# EAGLE design CCM_0015 (EAGLE 8.6.0)

## Sheet 1 of 6: CCM Subrack Bus
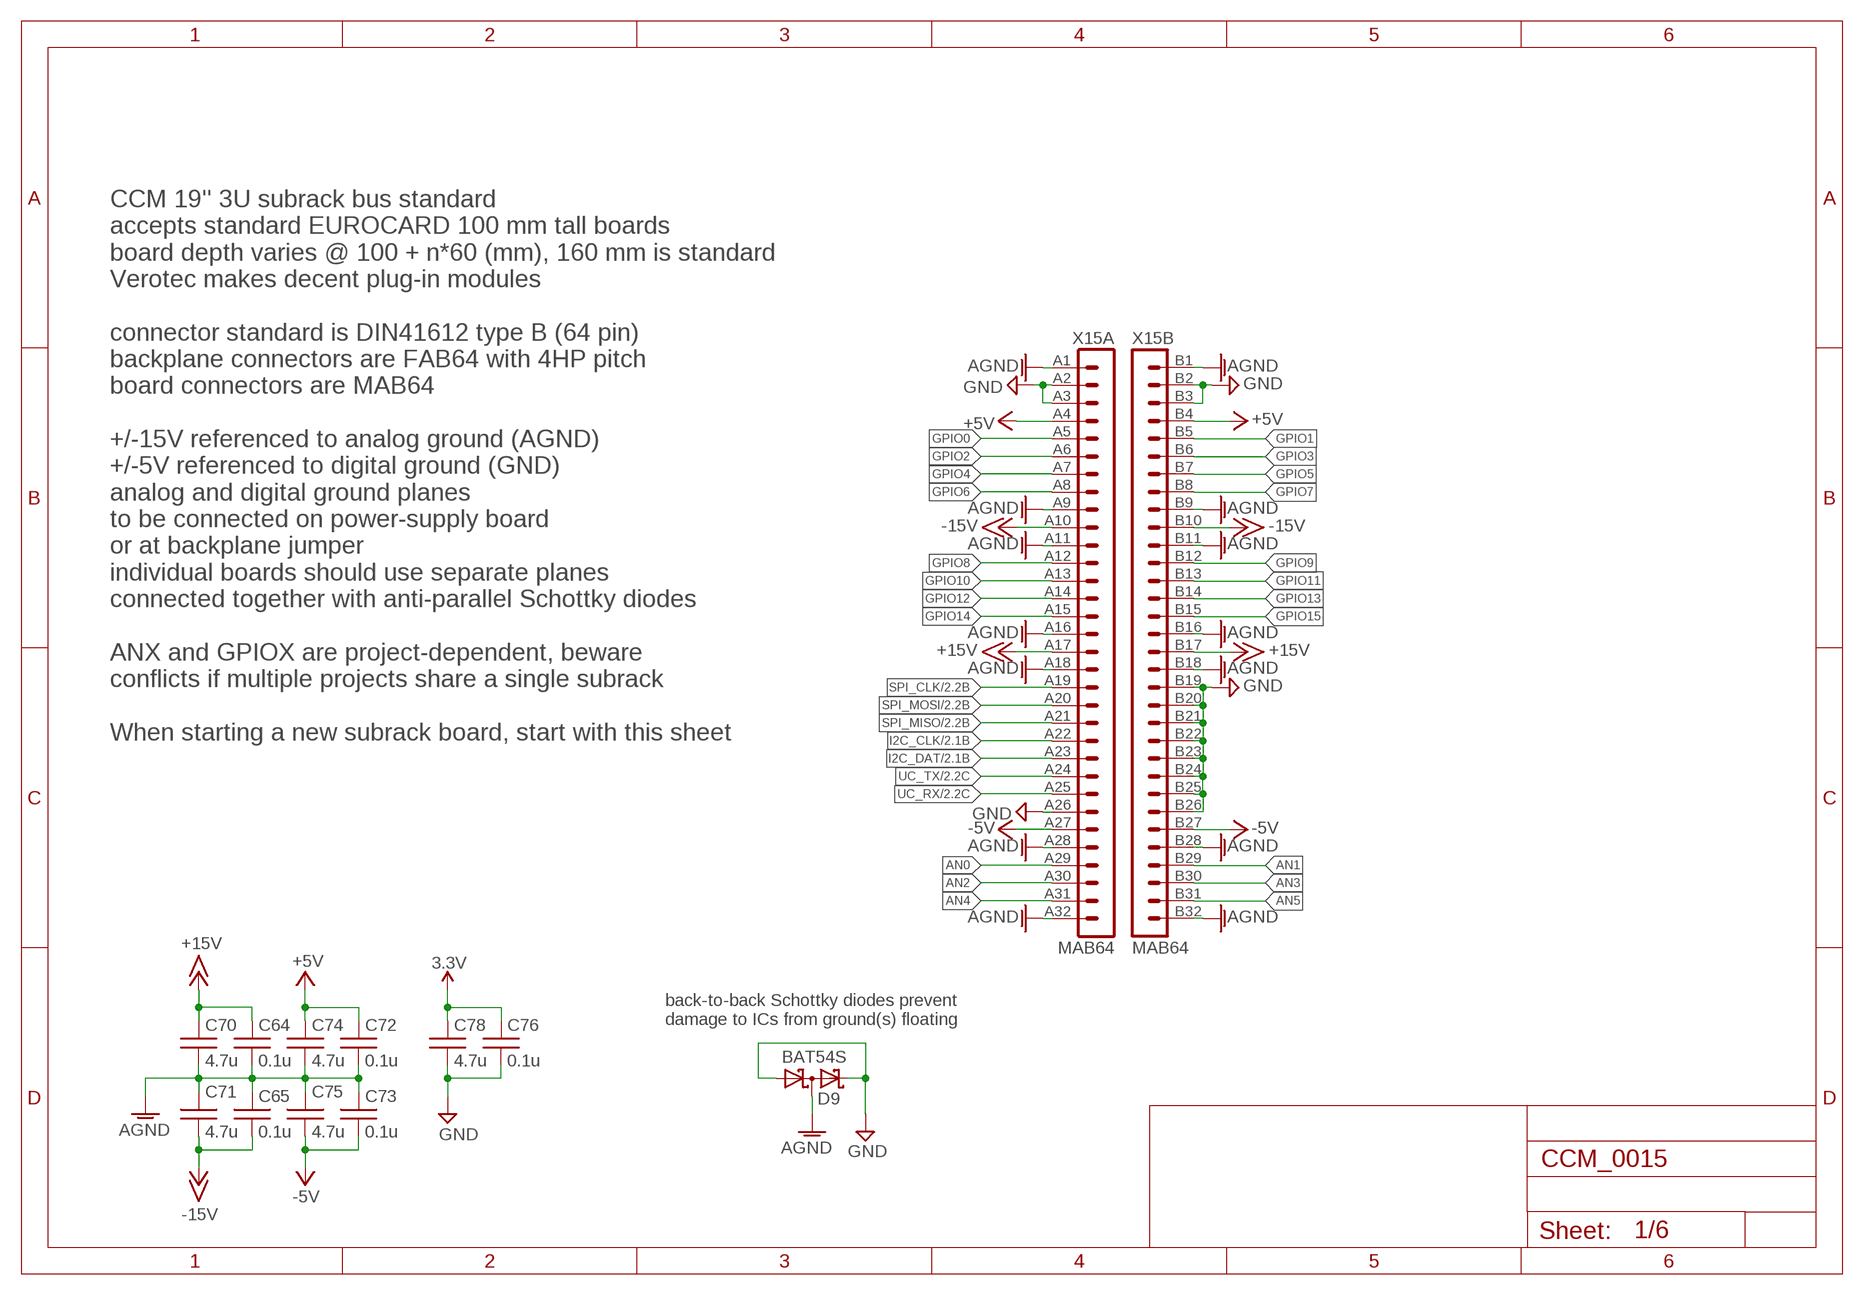
[diagram p0: schematic, sheet 1]

### Parts
C64  0.1u  C0603  [0603]
C65  0.1u  C0603  [0603]
C70  4.7u  C0603  [0603]
C71  4.7u  C0603  [0603]
C72  0.1u  C0603  [0603]
C73  0.1u  C0603  [0603]
C74  4.7u  C0603  [0603]
C75  4.7u  C0603  [0603]
C76  0.1u  C0603  [0603]
C78  4.7u  C0603  [0603]
D9  BAT54S  [SOT23]
X15  MAB64  [MAB64]

### Nets
3.3V: C76.1 C78.1 ; also sheet 3,4,5,6
+5V: C72.1 C74.1 X15.A4 X15.B4 ; also sheet 2,3,4,5
+15V: C64.1 C70.1 X15.A17 X15.B17
-5V: C73.2 C75.2 X15.A27 X15.B27 ; also sheet 4
-15V: C65.2 C71.2 X15.A10 X15.B10
AGND: C64.2 C65.1 C70.2 C71.1 D9.3(C1A2) X15.A1 X15.A9 X15.A11 X15.A16 X15.A18 X15.A28 X15.A32 X15.B1 X15.B9 X15.B11 X15.B16 X15.B18 X15.B28 X15.B32 ; also sheet 3,4,5,6
AGND1: C72.2 C73.1 C74.2 C75.1
AN0: X15.A29
AN1: X15.B29
AN2: X15.A30
AN3: X15.B30
AN4: X15.A31
AN5: X15.B31
GND: C76.2 C78.2 D9.1(A1) D9.2(C2) X15.A2 X15.A3 X15.A26 X15.B2 X15.B3 X15.B19 X15.B20 X15.B21 X15.B22 X15.B23 X15.B24 X15.B25 X15.B26 ; also sheet 2,3,4,5
GPIO0: X15.A5
GPIO1: X15.B5
GPIO2: X15.A6
GPIO3: X15.B6
GPIO4: X15.A7
GPIO5: X15.B7
GPIO6: X15.A8
GPIO7: X15.B8
GPIO8: X15.A12
GPIO9: X15.B12
GPIO10: X15.A13
GPIO11: X15.B13
GPIO12: X15.A14
GPIO13: X15.B14
GPIO14: X15.A15
GPIO15: X15.B15
I2C_CLK: X15.A22 ; also sheet 2
I2C_DAT: X15.A23 ; also sheet 2
SPI_CLK: X15.A19 ; also sheet 2,3,4,5
SPI_MISO: X15.A21 ; also sheet 2,4,5
SPI_MOSI: X15.A20 ; also sheet 2,3,4,5
UC_RX: X15.A25 ; also sheet 2
UC_TX: X15.A24 ; also sheet 2

### Notes on the sheet
- CCM 19'' 3U subrack bus standard
  accepts standard EUROCARD 100 mm tall boards
  board depth varies @ 100 + n*60 (mm), 160 mm is standard
  Verotec makes decent plug-in modules
  
  connector standard is DIN41612 type B (64 pin)
  backplane connectors are FAB64 with 4HP pitch 
  board connectors are MAB64
  
  +/-15V referenced to analog ground (AGND)
  +/-5V referenced to digital ground (GND)
  analog and digital ground planes
  to be connected on power-supply board
  or at backplane jumper
  individual boards should use separate planes
  connected together with anti-parallel Schottky diodes
  
  ANX and GPIOX are project-dependent, beware 
  conflicts if multiple projects share a single subrack
  
  When starting a new subrack board, start with this sheet
- back-to-back Schottky diodes prevent 
  damage to ICs from ground(s) floating

## Sheet 2 of 6: uC
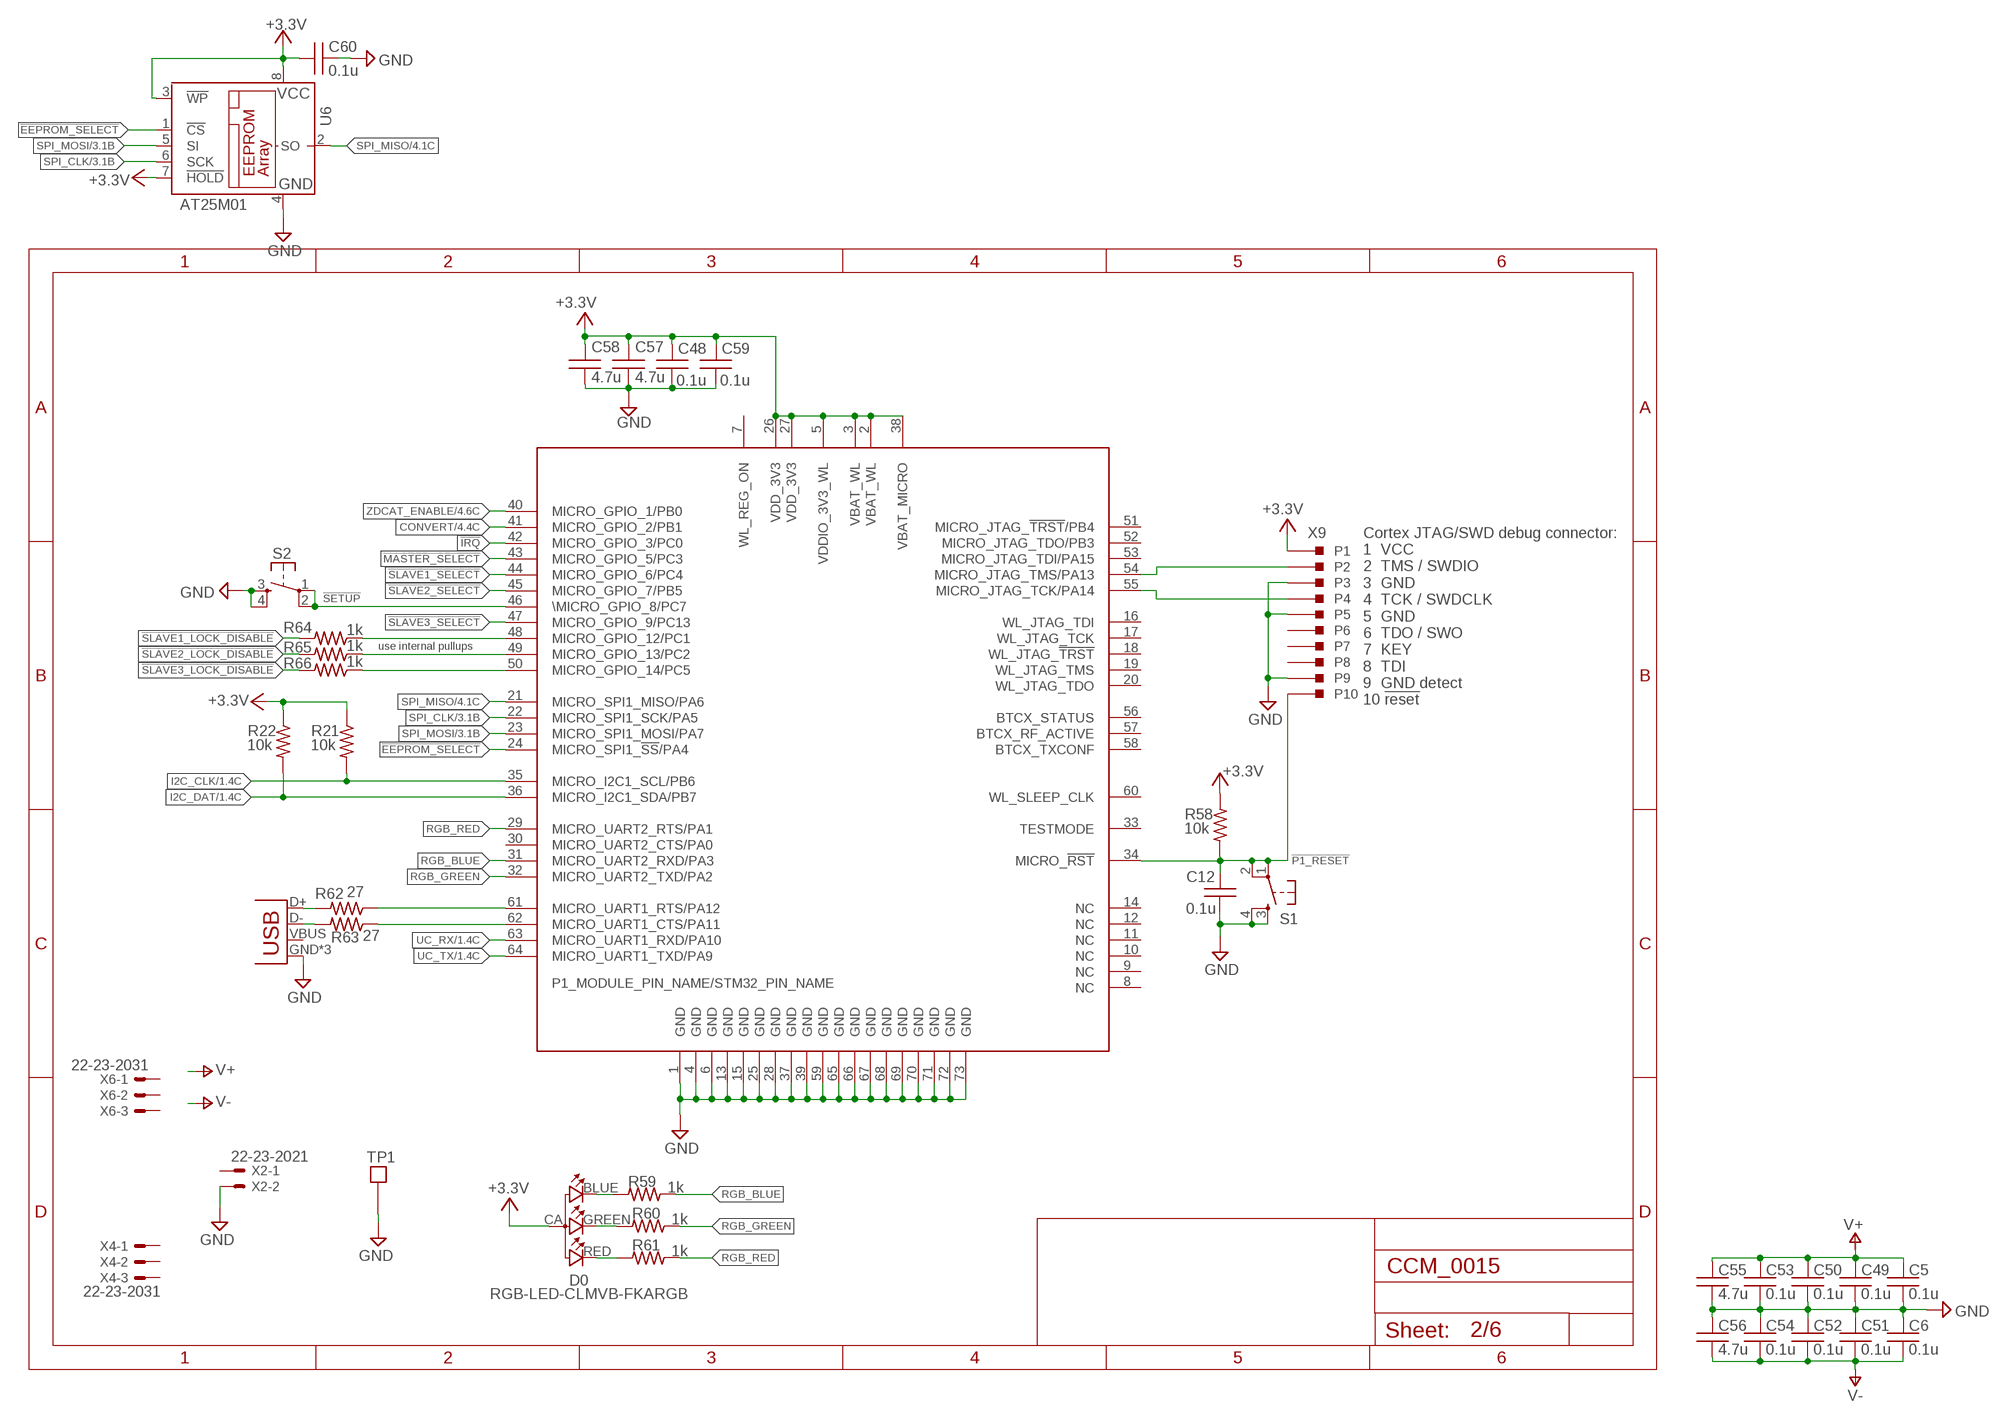
[diagram p1: schematic, sheet 2]

### Parts
C5  0.1u  C0603  [0603]
C6  0.1u  C0603  [0603]
C12  0.1u  C0603  [0603]
C48  0.1u  C0603  [0603]
C49  0.1u  C0603  [0603]
C50  0.1u  C0603  [0603]
C51  0.1u  C0603  [0603]
C52  0.1u  C0603  [0603]
C53  0.1u  C0603  [0603]
C54  0.1u  C0603  [0603]
C55  4.7u  C0603  [0603]
C56  4.7u  C0603  [0603]
C57  4.7u  C0603  [0603]
C58  4.7u  C0603  [0603]
C59  0.1u  C0603  [0603]
C60  0.1u  C0603  [0603]
D0  RGB-LED-CLMVB-FKARGB  [PLCC4-2MM-RGB]
R21  10k  R0603  [0603]
R22  10k  R0603  [0603]
R58  10k  R0603  [0603]
R59  1k  R0603  [0603]
R60  1k  R0603  [0603]
R61  1k  R0603  [0603]
R62  27  R0603  [0603]
R63  27  R0603  [0603]
R64  1k  R0603  [0603]
R65  1k  R0603  [0603]
R66  1k  R0603  [0603]
S1  TAC_SWITCHSMD  [TACTILE_SWITCH_SMD]
S2  TAC_SWITCHSMD  [TACTILE_SWITCH_SMD]
TP1  TESTPOINT  [TESTPOINT]
U6  AT25M01  25LC080SN  [SO-08]
U$3  P1  [WM-N-BM-14]
X2  22-23-2021  [22-23-2021]
X4  22-23-2031  [22-23-2031]
X6  22-23-2031  [22-23-2031]
X9  SHF-105  [SHF-105-01-X-D-SM]
X10  USB-MICROB  [USB-MICROB]

### Nets
!EEPROM_SELECT!: U6.1(!CS) U$3.24(MICRO_SPI1_!SS!/PA4)
!IRQ: U$3.42(MICRO_GPIO_3/PC0)
!MASTER_SELECT!: U$3.43(MICRO_GPIO_5/PC3)
!P1_RESET: C12.1 R58.2 S1.1 S1.2 X9.10
!SETUP: S2.1 S2.2 U$3.46(\MICRO_GPIO_8/PC7)
!SLAVE1_LOCK_DISABLE!: R64.2
!SLAVE1_SELECT!: U$3.44(MICRO_GPIO_6/PC4)
!SLAVE2_LOCK_DISABLE!: R65.2
!SLAVE2_SELECT!: U$3.45(MICRO_GPIO_7/PB5)
!SLAVE3_LOCK_DISABLE!: R66.2
!SLAVE3_SELECT!: U$3.47(MICRO_GPIO_9/PC13)
+3.3V: C48.1 C57.2 C58.2 C59.1 C60.1 D0.CA R58.1 U6.3(!WP) U6.7(!HOLD) U6.8(VCC) U$3.2(VBAT_WL) U$3.3(VBAT_WL) U$3.5(VDDIO_3V3_WL) U$3.26(VDD_3V3) U$3.27(VDD_3V3) U$3.38(VBAT_MICRO) X9.1
+5V: R21.1 R22.1 ; supply symbol labelled +3.3V ; also sheet 1,3,4,5
CONVERT: U$3.41(MICRO_GPIO_2/PB1) ; also sheet 4,5
D+: R62.2 X10.D+
D-: R63.2 X10.D-
GND: C5.2 C6.1 C12.2 C48.2 C49.2 C50.2 C51.1 C52.1 C53.2 C54.1 C55.2 C56.1 C57.1 C58.1 C59.2 C60.2 S1.3 S1.4 S2.3 S2.4 TP1.P$1 U6.4(GND) U$3.1(GND) U$3.4(GND) U$3.6(GND) U$3.13(GND) U$3.15(GND) U$3.25(GND) U$3.28(GND) U$3.37(GND) U$3.39(GND) U$3.59(GND) U$3.65(GND) U$3.66(GND) U$3.67(GND) U$3.68(GND) U$3.69(GND) U$3.70(GND) U$3.71(GND) U$3.72(GND) U$3.73(GND) X2.2 X9.3 X9.5 X9.9 X10.GND X10.MT1(GND) X10.MT2(GND) ; also sheet 1,3,4,5
I2C_CLK: R21.2 U$3.35(MICRO_I2C1_SCL/PB6) ; also sheet 1
I2C_DAT: R22.2 U$3.36(MICRO_I2C1_SDA/PB7) ; also sheet 1
N$1: R64.1 U$3.48(MICRO_GPIO_12/PC1)
N$25: R65.1 U$3.49(MICRO_GPIO_13/PC2)
N$27: R66.1 U$3.50(MICRO_GPIO_14/PC5)
N$78: R62.1 U$3.61(MICRO_UART1_RTS/PA12)
N$79: D0.BLUE R59.2
N$80: D0.GREEN R60.2
N$81: D0.RED R61.2
N$82: R63.1 U$3.62(MICRO_UART1_CTS/PA11)
P1_SWDCLK: U$3.55(MICRO_JTAG_TCK/PA14) X9.4
P1_SWDIO: U$3.54(MICRO_JTAG_TMS/PA13) X9.2
RGB_BLUE: R59.1 U$3.31(MICRO_UART2_RXD/PA3)
RGB_GREEN: R60.1 U$3.32(MICRO_UART2_TXD/PA2)
RGB_RED: R61.1 U$3.29(MICRO_UART2_RTS/PA1)
SPI_CLK: U6.6(SCK) U$3.22(MICRO_SPI1_SCK/PA5) ; also sheet 1,3,4,5
SPI_MISO: U6.2(SO) U$3.21(MICRO_SPI1_MISO/PA6) ; also sheet 1,4,5
SPI_MOSI: U6.5(SI) U$3.23(MICRO_SPI1_MOSI/PA7) ; also sheet 1,3,4,5
UC_RX: U$3.63(MICRO_UART1_RXD/PA10) ; also sheet 1
UC_TX: U$3.64(MICRO_UART1_TXD/PA9) ; also sheet 1
V+: C5.1 C49.1 C50.1 C53.1 C55.1 ; also sheet 3,5,6
V-: C6.2 C51.2 C52.2 C54.2 C56.2 ; also sheet 3,6
ZDCAT_ENABLE: U$3.40(MICRO_GPIO_1/PB0) ; also sheet 4
Unconnected: U$3.7(WL_REG_ON) U$3.8(NC) U$3.9(NC) U$3.10(NC) U$3.11(NC) U$3.12(NC) U$3.14(NC) U$3.16(WL_JTAG_TDI) U$3.17(WL_JTAG_TCK) U$3.18(WL_JTAG_!TRST!) U$3.19(WL_JTAG_TMS) U$3.20(WL_JTAG_TDO) U$3.30(MICRO_UART2_CTS/PA0) U$3.33(TESTMODE) U$3.34(MICRO_!RST!) U$3.51(MICRO_JTAG_!TRST!/PB4) U$3.52(MICRO_JTAG_TDO/PB3) U$3.53(MICRO_JTAG_TDI/PA15) U$3.56(BTCX_STATUS) U$3.57(BTCX_RF_ACTIVE) U$3.58(BTCX_TXCONF) U$3.60(WL_SLEEP_CLK) X2.1 X4.1 X4.2 X4.3 X6.1 X6.2 X6.3 X9.6 X9.7 X9.8 X10.VBUS

### Notes on the sheet
- Cortex JTAG/SWD debug connector:
  1  VCC
  2  TMS / SWDIO
  3  GND
  4  TCK / SWDCLK
  5  GND
  6  TDO / SWO
  7  KEY
  8  TDI
  9  GND detect
  10 !reset!
- use internal pullups

## Sheet 3 of 6: triangle wave generation
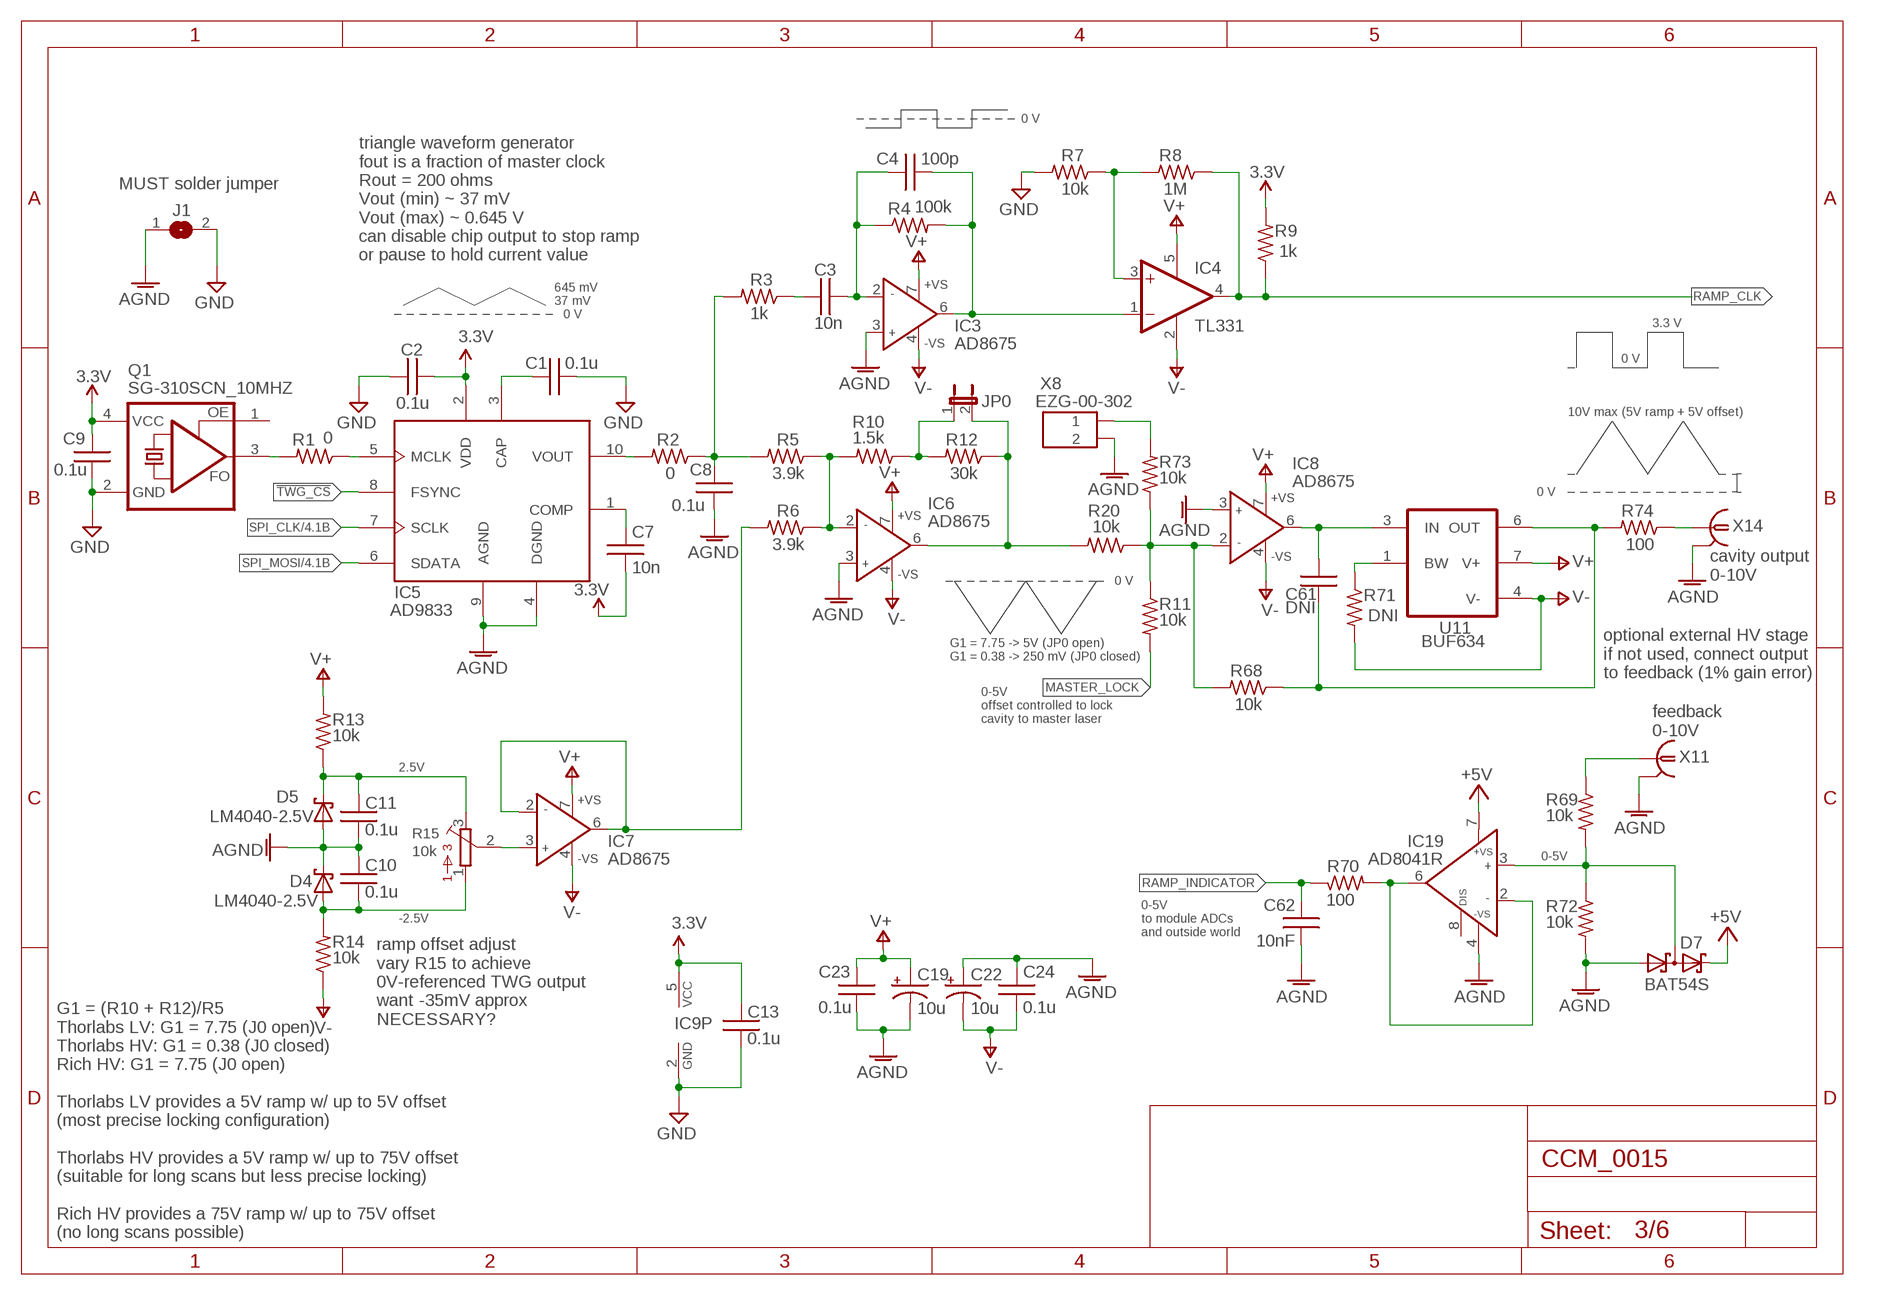
[diagram p2: schematic, sheet 3]

### Parts
C1  0.1u  C0603  [0603]
C2  0.1u  C0603  [0603]
C3  10n  C0603  [0603]
C4  100p  C0603  [0603]
C7  10n  C0603  [0603]
C8  0.1u  C0603  [0603]
C9  0.1u  C0603  [0603]
C10  0.1u  C0603  [0603]
C11  0.1u  C0603  [0603]
C13  0.1u  C0603  [0603]
C19  10u  CAP_POL1206  [EIA3216]
C22  10u  CAP_POL1206  [EIA3216]
C23  0.1u  C0603  [0603]
C24  0.1u  C0603  [0603]
C61  DNI  C0603  [0603]
C62  10nF  C0603  [0603]
D4  LM4040-2.5V  LM4040  [SOT23]
D5  LM4040-2.5V  LM4040  [SOT23]
D7  BAT54S  [SOT23]
IC3  AD8675  AD825_BR  [SO8]
IC4  TL331  [DBV-R-PDSO-G5]
IC5  AD9833  AD9833/7  [MSOP10]
IC6  AD8675  AD825_BR  [SO8]
IC7  AD8675  AD825_BR  [SO8]
IC8  AD8675  AD825_A  [SO08]
IC9  741G3157DBVR  [DBV_R-PDSO-G6]
IC19  AD8041R  [SO8]
J1  SJ  [SJ]
JP0  JP1E  [JP1]
Q1  SG-310SCN_10MHZ  ASF1  [ASF]
R1  0  R0603  [0603]
R2  0  R0603  [0603]
R3  1k  R0603  [0603]
R4  100k  R0603  [0603]
R5  3.9k  R0603  [0603]
R6  3.9k  R0603  [0603]
R7  10k  R0603  [0603]
R8  1M  R0603  [0603]
R9  1k  R0603  [0603]
R10  1.5k  R0603  [0603]
R11  10k  R0603  [0603]
R12  30k  R0603  [0603]
R13  10k  R0603  [0603]
R14  10k  R0603  [0603]
R15  10k  3386-H  [3386H]
R20  10k  R0603  [0603]
R68  10k  R0603  [0603]
R69  10k  R0603  [0603]
R70  100  R0603  [0603]
R71  DNI  R0603  [0603]
R72  10k  R0603  [0603]
R73  10k  R0603  [0603]
R74  100  R0603  [0603]
U11  BUF634  [SO8]
X8  EZG-00-302  [EZG-00-302]
X11  1-227161-0  [AMP_227161]
X14  1-227161-0  [AMP_227161]

### Nets
3.3V: C2.1 C7.1 C9.1 C13.1 IC5.2(VDD) IC9.5(VCC) Q1.4(VCC) R9.2 ; also sheet 1,4,5,6
!TWG_CS: IC5.8(FSYNC)
+5V: D7.2(C2) IC19.7(+VS) ; also sheet 1,2,4,5
AGND: C8.2 C10.1 C11.2 C19.C(-) C22.A(+) C23.2 C24.1 C62.2 D4.1(C) D5.2(A) D7.1(A1) IC3.3(IN+) IC5.4(DGND) IC5.9(AGND) IC6.3(IN+) IC8.3(IN+) IC19.4(-VS) J1.1 R72.2 X8.2 X11.2 X14.2 ; also sheet 1,4,5,6
CAVITY_DRIVE_RAW: C61.1 IC8.6(OUT) U11.3(IN)
GND: C1.1 C2.2 C9.2 C13.2 IC9.2(GND) J1.2 Q1.2(GND) R7.2 ; also sheet 1,2,4,5
MASTER_LOCK: R11.2
N$3: IC5.10(VOUT) R2.2
N$4: IC8.2(IN-) R11.1 R20.1 R68.2 R73.1
N$6: IC4.3(+IN) R7.1 R8.2
N$9: C1.2 IC5.3(CAP)
N$10: C3.1 R3.1
N$11: C3.2 C4.2 IC3.2(IN-) R4.1
N$12: C4.1 IC3.6(OUT) IC4.1(-IN) R4.2
N$13: C10.2 D4.2(A) R14.2 R15.1
N$14: IC7.3(IN+) R15.2
N$16: IC6.2(IN-) R5.1 R6.1 R10.2
N$17: C61.2 R68.1 R74.2 U11.6(OUT)
N$18: C11.1 D5.1(C) R13.1 R15.3
N$19: R69.1 X11.1
N$23: Q1.3(FO) R1.2
N$24: C7.2 IC5.1(COMP)
N$26: IC5.5(MCLK) R1.1
N$29: JP0.1 R10.1 R12.2
N$50: IC7.2(IN-) IC7.6(OUT) R6.2
N$70: IC6.6(OUT) JP0.2 R12.1 R20.2
N$71: IC19.2(IN-) IC19.6(OUT) R70.2
N$84: R71.1 U11.1(BW)
N$85: D7.3(C1A2) IC19.3(IN+) R69.2 R72.1
N$86: R73.2 X8.1
RAMP_CLK: IC4.4(OUT) R8.1 R9.1
RAMP_INDICATOR: C62.1 R70.1
RAMP_RAW: R74.1 X14.1
SPI_CLK: IC5.7(SCLK) ; also sheet 1,2,4,5
SPI_MOSI: IC5.6(SDATA) ; also sheet 1,2,4,5
TWG_RAW: C8.1 R2.1 R3.2 R5.2
V+: C19.A(+) C23.1 IC3.7(+VS) IC4.5(V+) IC6.7(+VS) IC7.7(+VS) IC8.7(+VS) R13.2 U11.7(V+) ; also sheet 2,5,6
V-: C22.C(-) C24.2 IC3.4(-VS) IC4.2(GND) IC6.4(-VS) IC7.4(-VS) IC8.4(-VS) R14.1 R71.2 U11.4(V-) ; also sheet 2,6
Unconnected: IC9.1(B) IC9.3(A) IC9.4(X) IC9.6(!A!/B) IC19.8(DISABLE) Q1.1(OE)

### Notes on the sheet
- 0 V
- MUST solder jumper
- triangle waveform generator
  fout is a fraction of master clock
  Rout = 200 ohms
  Vout (min) ~ 37 mV
  Vout (max) ~ 0.645 V
  can disable chip output to stop ramp
  or pause to hold current value
- 645 mV
- 37 mV
- 0 V
- 3.3 V
- 0 V
- 10V max (5V ramp + 5V offset)
- 0 V
- cavity output
  0-10V
- 0 V
- G1 = 7.75 -> 5V (JP0 open)
  G1 = 0.38 -> 250 mV (JP0 closed)
- optional external HV stage
  if not used, connect output
  to feedback (1% gain error)
- 0-5V
  offset controlled to lock 
  cavity to master laser
- feedback
  0-10V
- 2.5V
- 0-5V
- -2.5V
- 0-5V
  to module ADCs
  and outside world
- ramp offset adjust
  vary R15 to achieve 
  0V-referenced TWG output
  want -35mV approx
  NECESSARY?
- G1 = (R10 + R12)/R5
  Thorlabs LV: G1 = 7.75 (J0 open)
  Thorlabs HV: G1 = 0.38 (J0 closed)
  Rich HV: G1 = 7.75 (J0 open)
  
  Thorlabs LV provides a 5V ramp w/ up to 5V offset
  (most precise locking configuration)
  
  Thorlabs HV provides a 5V ramp w/ up to 75V offset
  (suitable for long scans but less precise locking)
  
  Rich HV provides a 75V ramp w/ up to 75V offset
  (no long scans possible)

## Sheet 4 of 6: photodiode in and processing
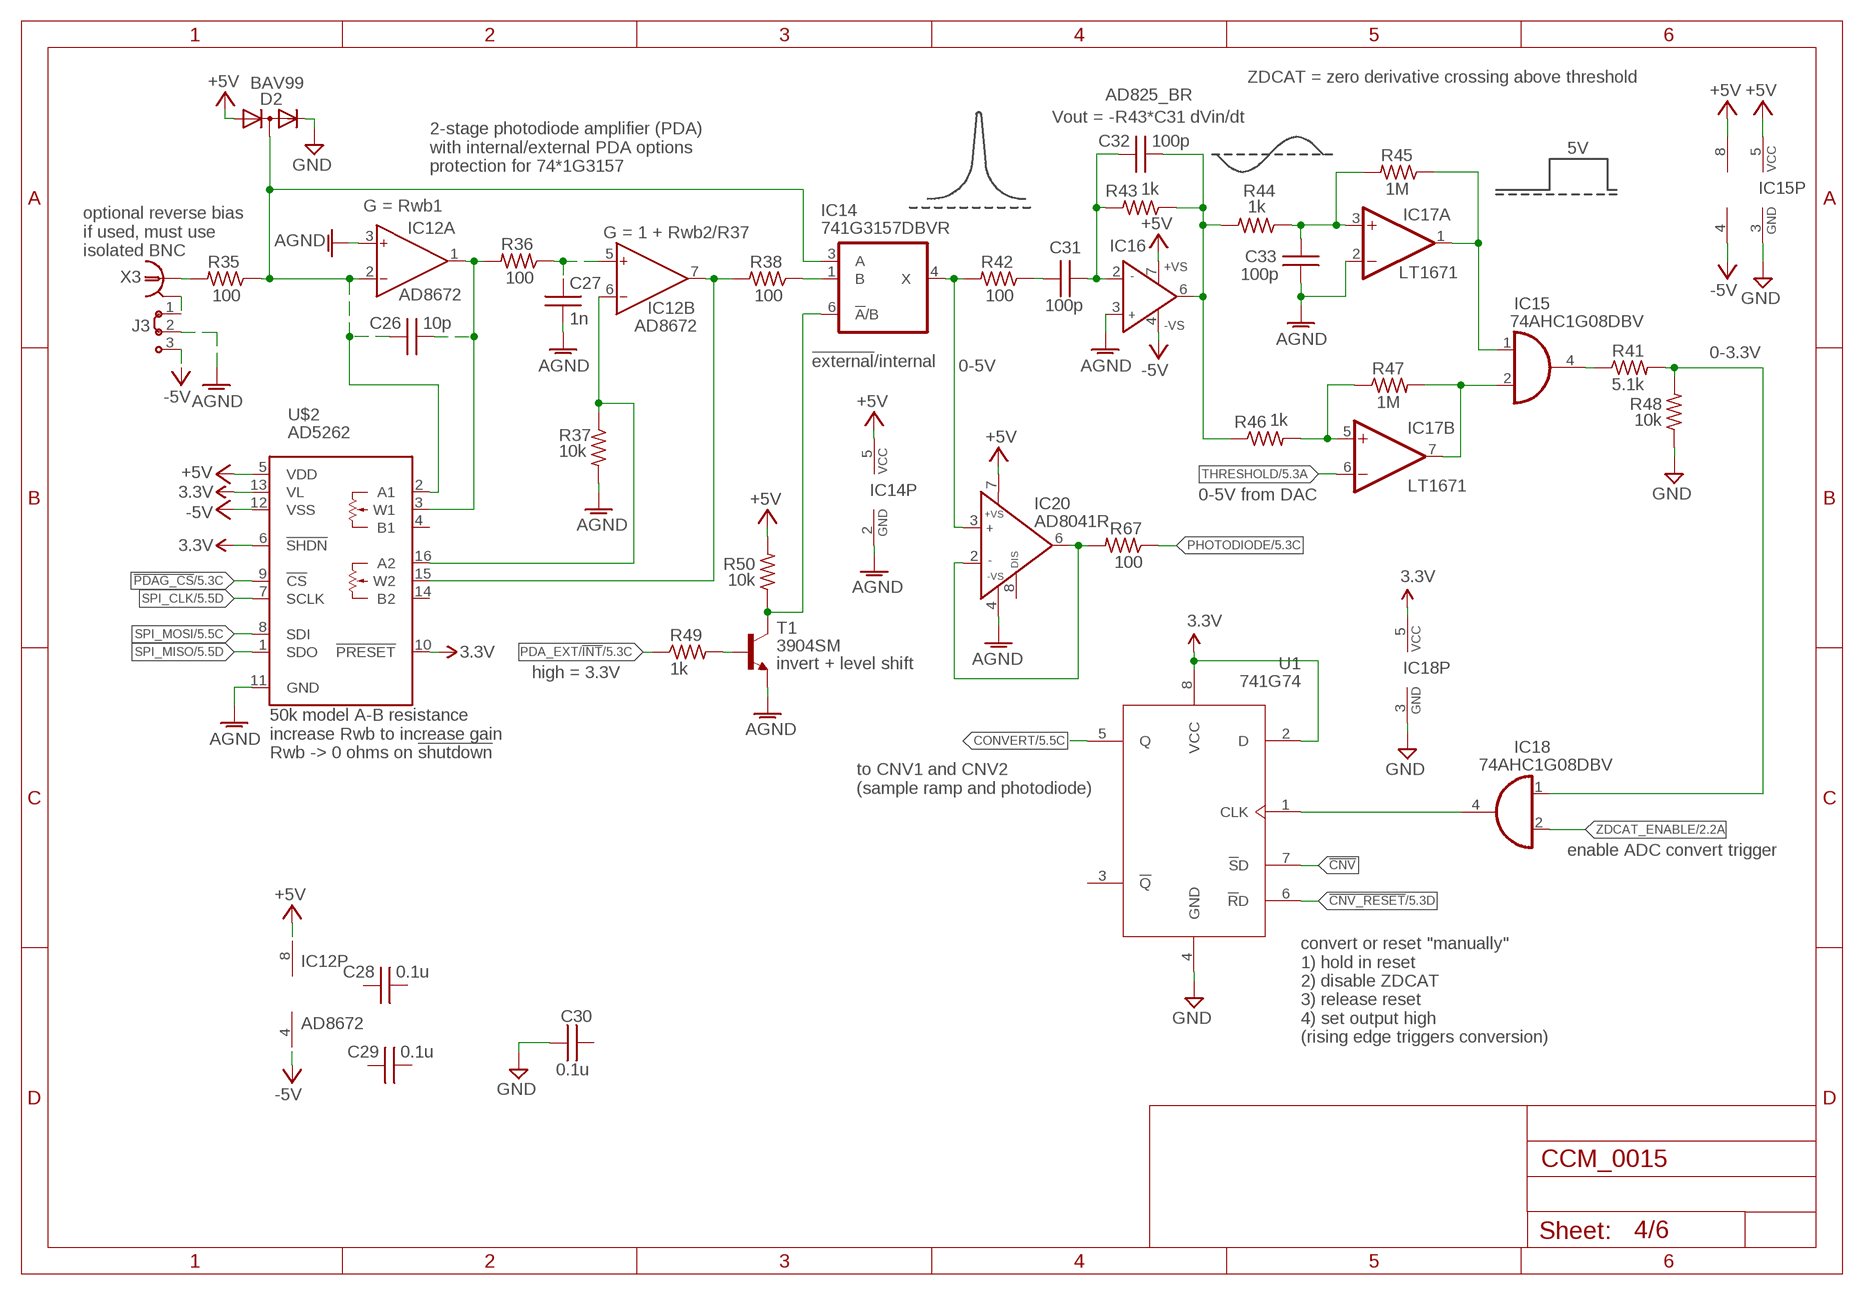
[diagram p3: schematic, sheet 4]

### Parts
C26  10p  C0603  [0603]
C27  1n  C0603  [0603]
C28  0.1u  C0603  [0603]
C29  0.1u  C0603  [0603]
C30  0.1u  C0603  [0603]
C31  100p  C0603  [0603]
C32  100p  C0603  [0603]
C33  100p  C0603  [0603]
D2  BAV99  [SOT23]
IC12  AD8672  AD8599R  [SO8]
IC14  741G3157DBVR  [DBV_R-PDSO-G6]
IC15  74AHC1G08DBV  [SOT23-5]
IC16  AD825_BR  [SO8]
IC17  LT1671  LM393D  [SO08]
IC18  74AHC1G08DBV  [SOT23-5]
IC20  AD8041R  [SO8]
J3  J2X2MM  [04C]
R35  100  R0603  [0603]
R36  100  R0603  [0603]
R37  10k  R0603  [0603]
R38  100  R0603  [0603]
R41  5.1k  R0603  [0603]
R42  100  R0603  [0603]
R43  1k  R0603  [0603]
R44  1k  R0603  [0603]
R45  1M  R0603  [0603]
R46  1k  R0603  [0603]
R47  1M  R0603  [0603]
R48  10k  R0603  [0603]
R49  1k  R0603  [0603]
R50  10k  R0603  [0603]
R67  100  R0603  [0603]
T1  3904SM  [SOT23]
U1  741G74  [TSSOP8]
U$2  AD5262  [TSSOP16]
X3  1-227161-0  [AMP_227161]

### Nets
3.3V: IC18.5(VCC) U1.2(D) U1.8(VCC) U$2.6(!SHDN) U$2.10(!PRESET!) U$2.13(VL) ; also sheet 1,3,5,6
!CNV!: U1.7(!S!D)
!CNV_RESET!: U1.6(!R!D) ; also sheet 5
!PDAG_CS!: U$2.9(!CS!) ; also sheet 5
+5V: D2.1(A) IC12.8(P:V+) IC14.5(VCC) IC15.5(VCC) IC16.7(+VS) IC17.8(P:V+) IC20.7(+VS) R50.2 U$2.5(VDD) ; also sheet 1,2,3,5
-5V: IC12.4(P:V-) IC16.4(-VS) IC17.4(P:V-) J3.3 U$2.12(VSS) ; also sheet 1
ABOVE_THRESHOLD: IC15.2(I1) IC17.7(B:OUT) R47.2
AGND: C27.2 C33.1 IC12.3(A:IN+) IC14.2(GND) IC16.3(IN+) IC17.2(A:-IN) IC20.4(-VS) J3.2 R37.2 T1.2(E) U$2.11(GND) ; also sheet 1,3,5,6
CONVERT: U1.5(Q) ; also sheet 2,5
DERIVATIVE_ZERO_CROSSING: IC15.1(I0) IC17.1(A:OUT) R45.1
GND: C30.2 D2.2(C) IC15.3(GND) IC18.3(GND) R48.1 U1.4(GND) ; also sheet 1,2,3,5
N2: IC14.4(X) IC20.3(IN+) R42.2
N$28: IC18.4(O) U1.1(CLK)
N$41: IC12.7(B:OUT) R38.2 U$2.15(W2)
N$47: J3.1 X3.2
N$48: C26.1 D2.3(AC) IC12.2(A:IN-) IC14.3(A) R35.1 U$2.2(A1)
N$49: IC12.6(B:IN-) R37.1 U$2.16(A2)
N$51: IC14.1(B) R38.1
N$52: C27.1 IC12.5(B:IN+) R36.1
N$53: C26.2 IC12.1(A:OUT) R36.2 U$2.3(W1)
N$54: IC15.4(O) R41.1
N$56: IC18.1(I0) R41.2 R48.2
N$57: R35.2 X3.1
N$59: R49.2 T1.1(B)
N$60: C31.1 R42.1
N$61: C32.2 IC16.6(OUT) R43.1 R44.2 R46.1
N$64: C31.2 C32.1 IC16.2(IN-) R43.2
N$65: C33.2 IC17.3(A:+IN) R44.1 R45.2
N$67: IC17.5(B:+IN) R46.2 R47.1
N$83: IC20.2(IN-) IC20.6(OUT) R67.2
PDA_EXT/!INT!: R49.1 ; also sheet 5
PDA_INTERNAL/!EXTERNAL!: IC14.6(!A!/B) R50.1 T1.3(C)
PHOTODIODE: R67.1 ; also sheet 5
SPI_CLK: U$2.7(SCLK) ; also sheet 1,2,3,5
SPI_MISO: U$2.1(SDO) ; also sheet 1,2,5
SPI_MOSI: U$2.8(SDI) ; also sheet 1,2,3,5
THRESHOLD: IC17.6(B:-IN) ; also sheet 5
ZDCAT_ENABLE: IC18.2(I1) ; also sheet 2
Unconnected: C28.1 C28.2 C29.1 C29.2 C30.1 IC20.8(DISABLE) U1.3(!Q) U$2.4(B1) U$2.14(B2)

### Notes on the sheet
- ZDCAT = zero derivative crossing above threshold
- Vout = -R43*C31 dVin/dt
- 5V
- 2-stage photodiode amplifier (PDA)
  with internal/external PDA options
  protection for 74*1G3157
- G = Rwb1
- G = 1 + Rwb2/R37
- optional reverse bias
  if used, must use 
  isolated BNC
- 0-3.3V
- !external!/internal | 0-5V
- 0-5V from DAC
- invert + level shift
- high = 3.3V
- 50k model A-B resistance
  increase Rwb to increase gain
  Rwb -> 0 ohms on !shutdown!
- to CNV1 and CNV2 
  (sample ramp and photodiode)
- enable ADC convert trigger
- convert or reset "manually"
  1) hold in reset
  2) disable ZDCAT
  3) release reset
  4) set output high
  (rising edge triggers conversion)

## Sheet 5 of 6: Channel Guts
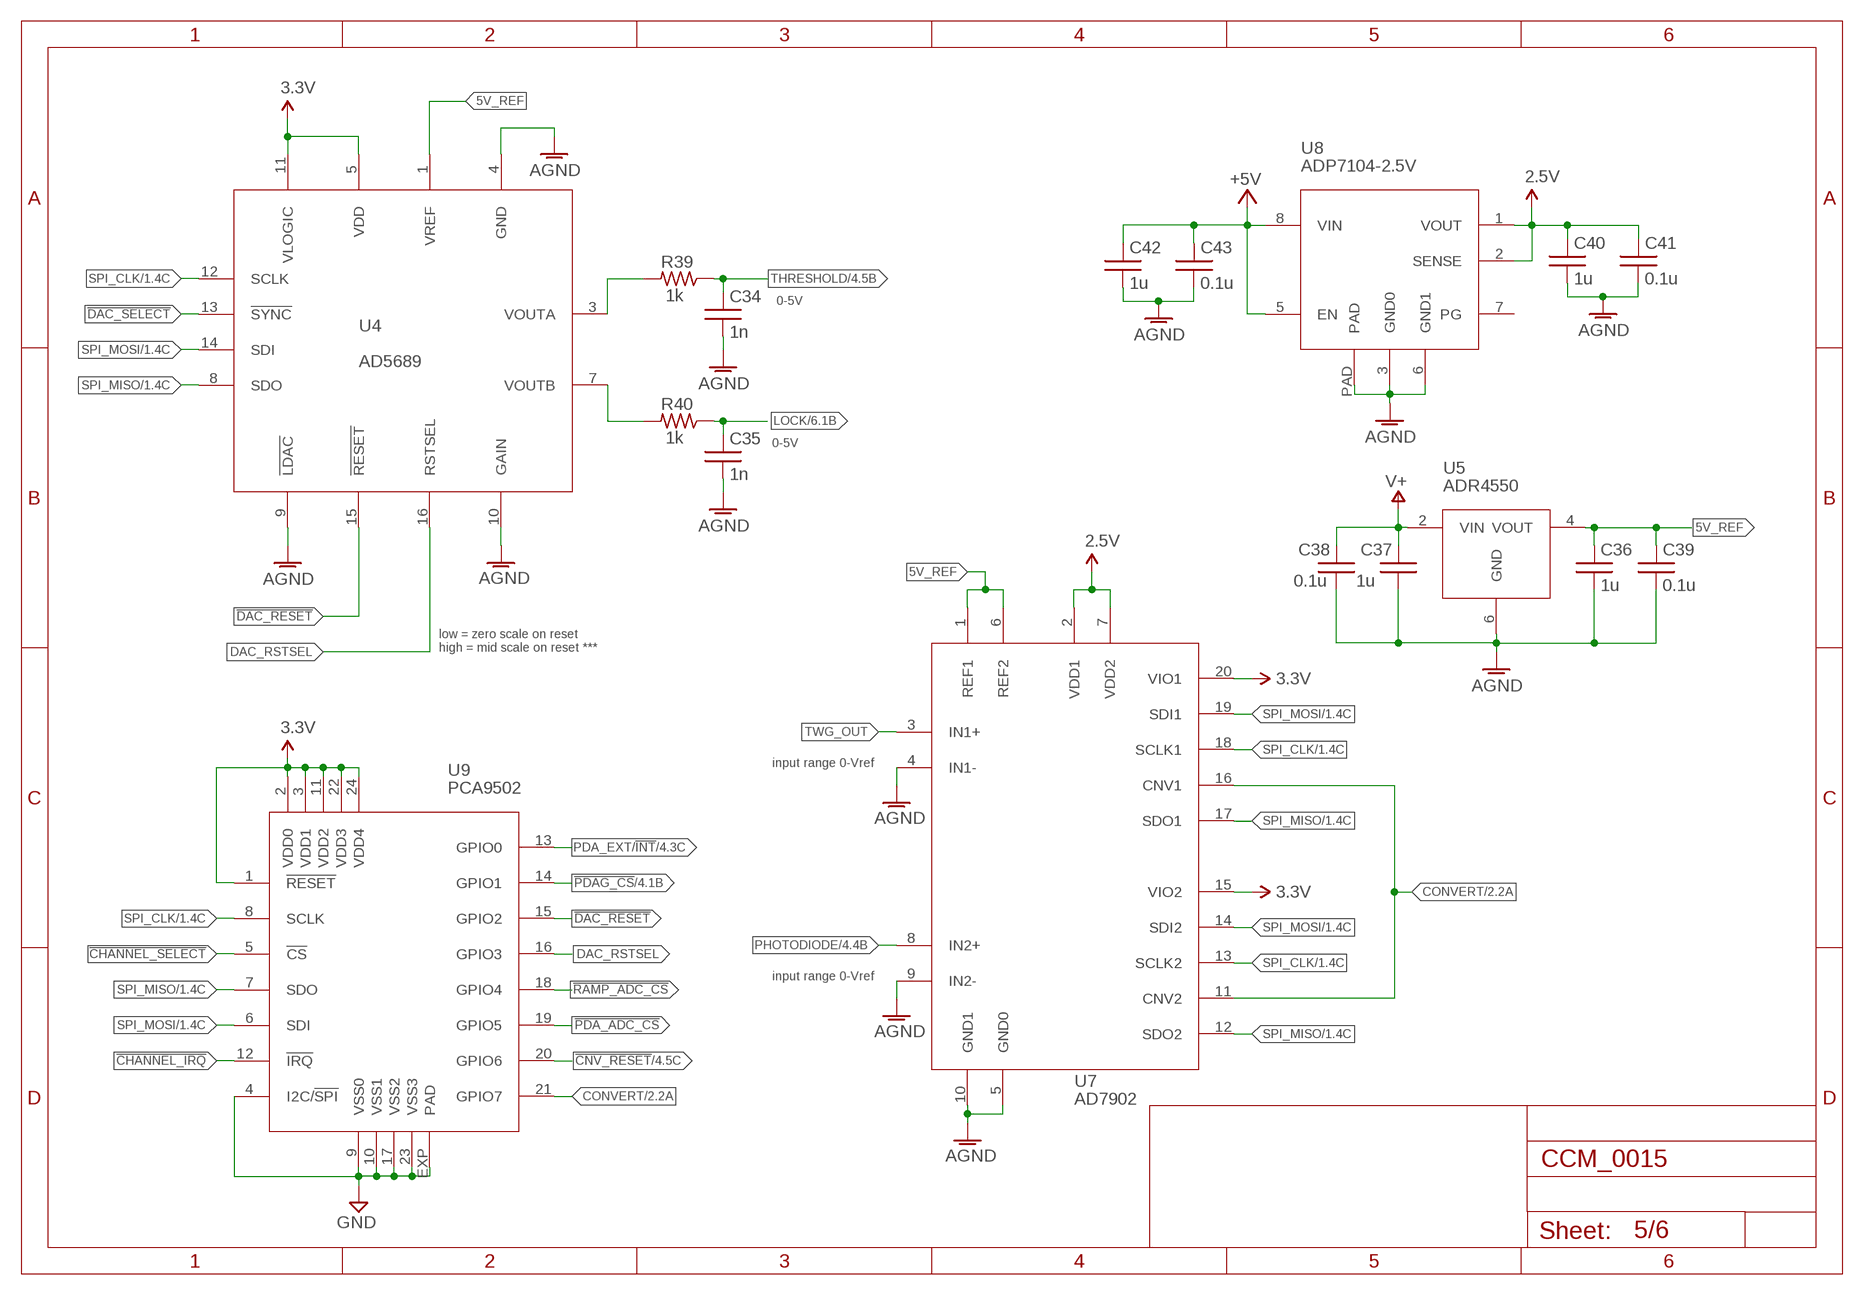
[diagram p4: schematic, sheet 5]

### Parts
C34  1n  C0603  [0603]
C35  1n  C0603  [0603]
C36  1u  C0603  [0603]
C37  1u  C0603  [0603]
C38  0.1u  C0603  [0603]
C39  0.1u  C0603  [0603]
C40  1u  C0603  [0603]
C41  0.1u  C0603  [0603]
C42  1u  C0603  [0603]
C43  0.1u  C0603  [0603]
R39  1k  R0603  [0603]
R40  1k  R0603  [0603]
U4  AD5689  [TSSOP16]
U5  ADR4550  ADR45XX  [SO8]
U7  AD7902  [QSOP20]
U8  ADP7104-2.5V  ADP7104  [SO8-POWER]
U9  PCA9502  [QFN24-4X4]

### Nets
2.5V: C40.1 C41.1 U7.2(VDD1) U7.7(VDD2) U8.1(VOUT) U8.2(SENSE)
3.3V: U4.5(VDD) U4.11(VLOGIC) U7.15(VIO2) U7.20(VIO1) U9.1(!RESET!) U9.2(VDD0) U9.3(VDD1) U9.11(VDD2) U9.22(VDD3) U9.24(VDD4) ; also sheet 1,3,4,6
5V_REF: C36.1 C39.1 U4.1(VREF) U5.4(VOUT) U7.1(REF1) U7.6(REF2)
!CHANNEL_IRQ!: U9.12(!IRQ!)
!CHANNEL_SELECT!: U9.5(!CS!)
!CNV_RESET!: U9.20(GPIO6) ; also sheet 4
!DAC_RESET!: U4.15(!RESET) U9.15(GPIO2)
!DAC_SELECT!: U4.13(!SYNC)
!PDA_ADC_CS!: U9.19(GPIO5)
!PDAG_CS!: U9.14(GPIO1) ; also sheet 4
!RAMP_ADC_CS!: U9.18(GPIO4)
+5V: C42.1 C43.1 U8.5(EN) U8.8(VIN) ; also sheet 1,2,3,4
AGND: C34.2 C35.2 C36.2 C37.2 C38.2 C39.2 C40.2 C41.2 C42.2 C43.2 U4.4(GND) U4.9(!LDAC) U4.10(GAIN) U5.6(GND) U7.4(IN1-) U7.5(GND0) U7.9(IN2-) U7.10(GND1) U8.3(GND0) U8.6(GND1) U8.PAD ; also sheet 1,3,4,6
CONVERT: U7.11(CNV2) U7.16(CNV1) U9.21(GPIO7) ; also sheet 2,4
DAC_RSTSEL: U4.16(RSTSEL) U9.16(GPIO3)
GND: U9.4(I2C/!SPI!) U9.9(VSS0) U9.10(VSS1) U9.17(VSS2) U9.23(VSS3) U9.EXP(PAD) ; also sheet 1,2,3,4
LOCK: C35.1 R40.1 ; also sheet 6
N$55: R39.2 U4.3(VOUTA)
N$62: R40.2 U4.7(VOUTB)
PDA_EXT/!INT!: U9.13(GPIO0) ; also sheet 4
PHOTODIODE: U7.8(IN2+) ; also sheet 4
SPI_CLK: U4.12(SCLK) U7.13(SCLK2) U7.18(SCLK1) U9.8(SCLK) ; also sheet 1,2,3,4
SPI_MISO: U4.8(SDO) U7.12(SDO2) U7.17(SDO1) U9.7(SDO) ; also sheet 1,2,4
SPI_MOSI: U4.14(SDI) U7.14(SDI2) U7.19(SDI1) U9.6(SDI) ; also sheet 1,2,3,4
THRESHOLD: C34.1 R39.1 ; also sheet 4
TWG_OUT: U7.3(IN1+)
V+: C37.1 C38.1 U5.2(VIN) ; also sheet 2,3,6
Unconnected: U8.7(PG)

### Notes on the sheet
- 0-5V
- 0-5V
- low = zero scale on reset
  high = mid scale on reset ***
- input range 0-Vref
- input range 0-Vref

## Sheet 6 of 6: slave drive
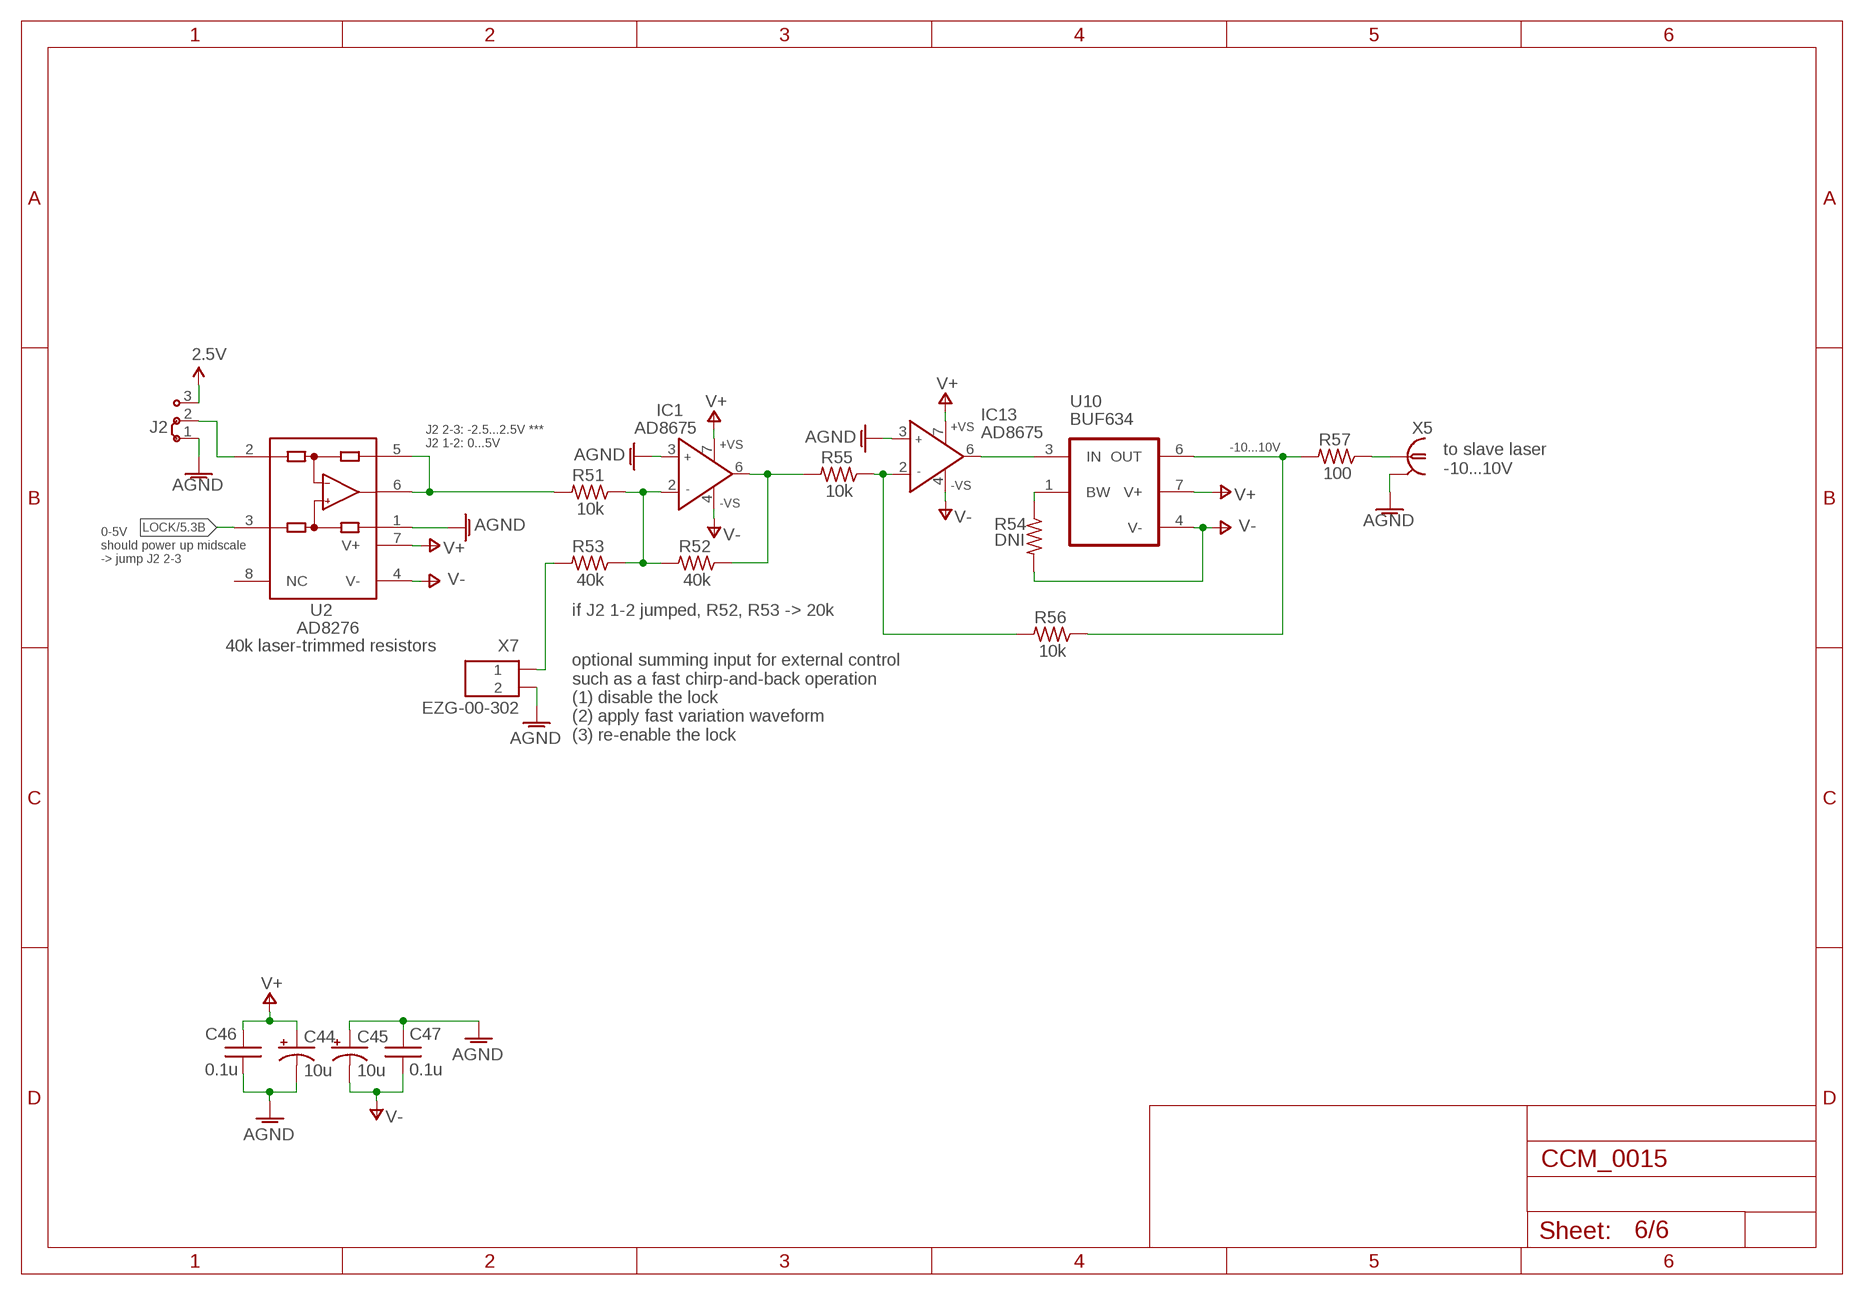
[diagram p5: schematic, sheet 6]

### Parts
C44  10u  CAP_POL1206  [EIA3216]
C45  10u  CAP_POL1206  [EIA3216]
C46  0.1u  C0603  [0603]
C47  0.1u  C0603  [0603]
IC1  AD8675  AD825_A  [SO08]
IC13  AD8675  AD825_A  [SO08]
J2  J2X2MM  [04C]
R51  10k  R0603  [0603]
R52  40k  R0603  [0603]
R53  40k  R0603  [0603]
R54  DNI  R0603  [0603]
R55  10k  R0603  [0603]
R56  10k  R0603  [0603]
R57  100  R0603  [0603]
U2  AD8276  [SO8]
U10  BUF634  [SO8]
X5  1-227161-0  [AMP_227161]
X7  EZG-00-302  [EZG-00-302]

### Nets
3.3V: J2.3 ; supply symbol labelled 2.5V ; also sheet 1,3,4,5
AGND: C44.C(-) C45.A(+) C46.2 C47.1 IC1.3(IN+) IC13.3(IN+) J2.1 U2.1(REF) X5.2 X7.2 ; also sheet 1,3,4,5
LOCK: U2.3(+IN) ; also sheet 5
N$15: R51.2 U2.5(SENSE) U2.6(OUT)
N$58: J2.2 U2.2(-IN)
N$63: IC1.2(IN-) R51.1 R52.2 R53.1
N$66: IC1.6(OUT) R52.1 R55.2
N$72: R54.1 U10.1(BW)
N$73: IC13.6(OUT) U10.3(IN)
N$74: R56.1 R57.2 U10.6(OUT)
N$75: R53.2 X7.1
N$76: R57.1 X5.1
N$77: IC13.2(IN-) R55.1 R56.2
V+: C44.A(+) C46.1 IC1.7(+VS) IC13.7(+VS) U2.7(V+) U10.7(V+) ; also sheet 2,3,5
V-: C45.C(-) C47.2 IC1.4(-VS) IC13.4(-VS) R54.2 U2.4(V-) U10.4(V-) ; also sheet 2,3
Unconnected: U2.8(NC)

### Notes on the sheet
- J2 2-3: -2.5...2.5V ***
  J2 1-2: 0...5V
- -10...10V
- to slave laser
  -10...10V
- 0-5V
  should power up midscale
  -> jump J2 2-3
- if J2 1-2 jumped, R52, R53 -> 20k
- 40k laser-trimmed resistors
- optional summing input for external control
  such as a fast chirp-and-back operation
  (1) disable the lock
  (2) apply fast variation waveform
  (3) re-enable the lock

## Library data of the parts
C1-C13 C23 C24 C26-C43 C46-C62 C64 C65 C70-C76 C78 = acrooptics:C: Capacitor
C19 C22 C44 C45 = acrooptics:CAP_POL: Capacitor Polarized These are standard SMD and PTH capacitors. Normally 10uF, 47uF, and 100uF in electrolytic and tantalum varieties. Always verify the external diameter of the through hole cap, it varies with capacity, voltage, and manufacturer. The EIA devices should be standard.
D0 = acrooptics:RGB-LED-CLMVB-FKA: CREE CLMVB-FKA RGB LED 2mm x 2mm
D2 = custom_parts:BAV99: 200mA 70V High Conductance Ultra-fast Switching Diode
D4 D5 = noah:LM4040: LM4040 Reference Zener Diode
D7 D9 = diode:BAT54S: Schottky Diodes Pin connection corrected 2011-05-04 Source: Fairchild .. BAT54.pdf
IC1 IC8 IC13 = noah:AD825_A: Low Cost, General-Purpose High Speed JFET Amplifier Source: http://www.analog.com/static/imported-files/data_sheets/AD825.pdf
IC3 IC6 IC7 IC16 = noah:AD825_B: Low Cost, General-Purpose High Speed JFET Amplifier Source: http://www.analog.com/static/imported-files/data_sheets/AD825.pdf; MF: ALTERA CORPORATION; MPN: AD825ARZ; OC_FARNELL: 9603735; OC_NEWARK: 59K6528
IC4 = linear:TL331: SINGLE DIFFERENTIAL COMPARATOR Source: Data sheet <http://www.ti.com/lit/ds/symlink/tl331-q1.pdf>
IC5 = custom_parts:AD9833/7: Analog Devices DDS Waveform generator The AD9833 is 12.5MHz (25MHz clock) the AD9837 is 8MHz (16MHz clock) both have 10 bit DACs
IC9 IC14 = 74xx-little-de:74*1G3157: Single-Pole, Double-Throw Analog Switch Source: http://focus.ti.com/lit/ds/symlink/sn74lvc1g3157.pdf
IC12 = analog-devices:AD8599: Single and Dual, Ultralow Distortion, Ultralow Noise Op Amps Source: http://www.analog.com/static/imported-files/data_sheets/AD8597_8599.pdf; MPN: AD8599ARZ; OC_FARNELL: 1438872; OC_NEWARK: 34M5072
IC15 IC18 = 74xx-little-de:74*1G08: 2-input AND gate
IC17 = linear:LM393: COMPARATOR
IC19 IC20 = analog-devices:AD8041: 160 MHz Rail-to-Rail Amplifier with Disable Source: http://www.analog.com/static/imported-files/data_sheets/AD8041.pdf; MF: ALTERA CORPORATION; MPN: AD8041ARZ; OC_FARNELL: 1464831; OC_NEWARK: 88H0130
J1 = acrooptics:SJ: SMD solder JUMPER
J2 J3 = jumper:J2: Jumper switch 2 x 2.5 mm
JP0 = jumper:JP1E: JUMPER
Q1 = crystal:ASF*: CRYSTAL CLOCK OSCILLATORS 5.0 Vdc or 3.3 Vdc - LOW PROFILE ULTRA MINIATURE CERAMIC SURFACE MOUNT Source: http://www.abracon.com/Oscillators/asf1-L-L1.pdf; OC_FARNELL: unknown; OC_NEWARK: unknown
R1-R14 R20-R22 R35-R74 = acrooptics:R: 0603 resistor
R15 = bourns:3386-: 3386 Series 3/8" Square Trimmer
S1 S2 = Spark:TAC_SWITCH: SMD Tactiile Switch
T1 = noah:3904: NPN TRANSISTOR
TP1 = Fitch:TESTPOINT
U1 = noah:74*1G74
U2 = noah:AD8276: Precision Unity Gain Diff. Amplifier
U4 = noah:AD5689
U5 = noah:ADR45XX
U6 = microchip:25*: Serial EEPROM 4K/ 8K , SPI bus; MF: MICROCHIP; MPN: AT25M01-SSHM-B
U7 = noah:AD7902
U8 = noah:ADP7104
U9 = noah:PCA9502
U10 U11 = noah:BUF634: 250mA High-Speed Buffer
U$2 = noah:AD5262
U$3 = acrooptics:P1: Particle P1 module (WiFi with antenna)
X2 = con-molex:22-23-2021: .100" (2.54mm) Center Header - 2 Pin; MF: MOLEX; MPN: 22-23-2021; OC_FARNELL: 1462926; OC_NEWARK: 25C3832
X3 X5 X11 X14 = con-coax:?227161*: JACK, RIGHT ANGLE, 50 OHM, PCB, BNC Source: amp_227161.pdf; MF: TYCO ELECTRONICS; MPN: 1-227161; OC_FARNELL: unknown; OC_NEWARK: 33B3200
X4 X6 = con-molex:22-23-2031: .100" (2.54mm) Center Header - 3 Pin; MF: MOLEX; MPN: 22-23-2031; OC_FARNELL: 1462950; OC_NEWARK: 30C0862
X7 X8 = con-lemo:EZG-?-302: LEMO Connector Source: http://www.lemo.com/pdfs/catalog/ROW/German/unipole_multipole.pdf; OC_FARNELL: unknown; OC_NEWARK: unknown
X9 = acrooptics:SHF-105
X10 = Spark:USB; PROD_ID: CONN-09505
X15 = noah:MAB64: CONNECTOR male, 94 pins, type B, rows AB, grid 2.54 mm

## Net classes
1 standard: width 0.61 mm, clearance 0.254 mm

## Board
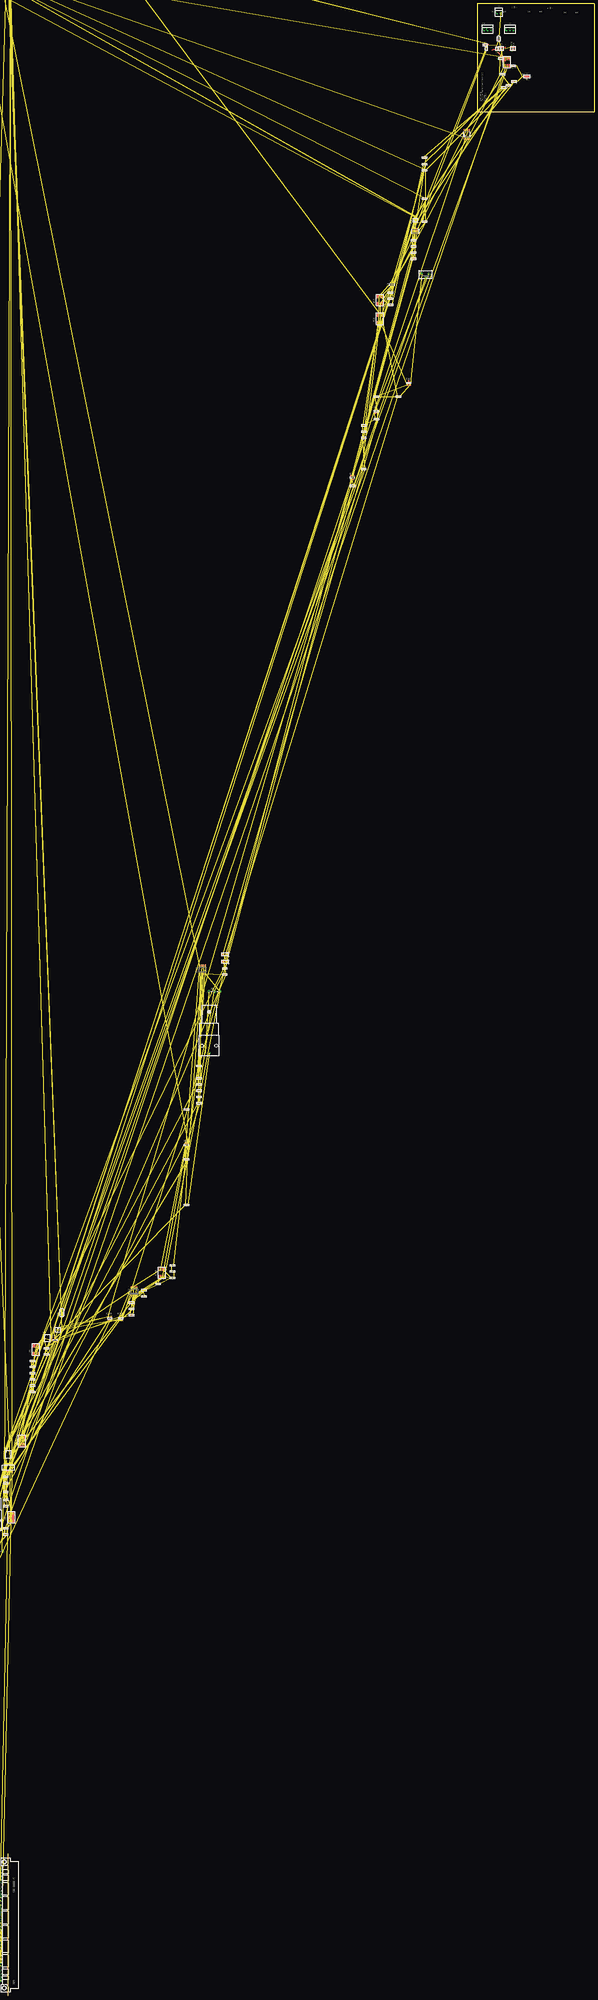
[diagram p6: board, top side]
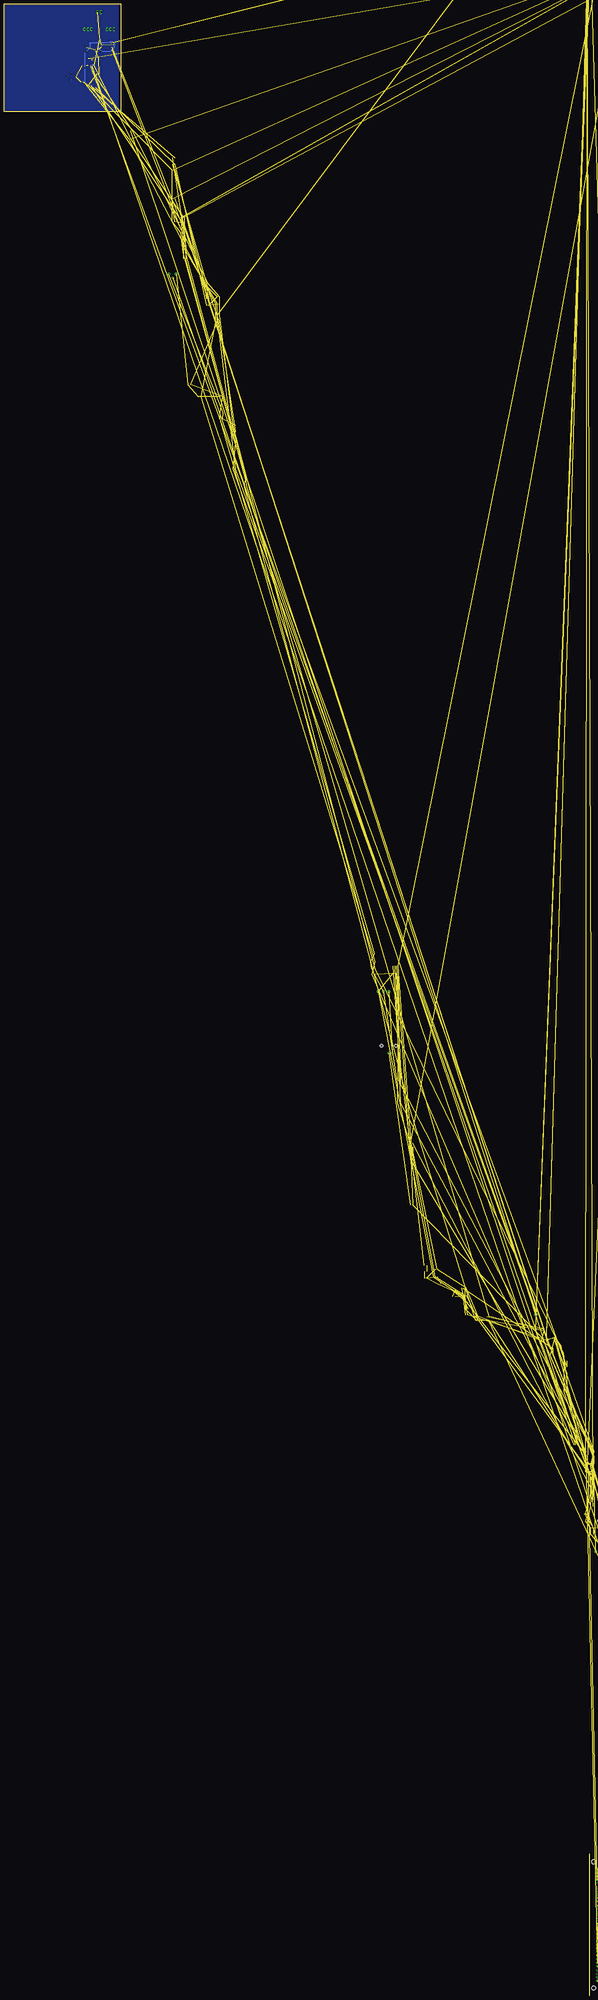
[diagram p7: board, bottom side, seen from below]

Size 82.55 x 76.2 mm. Coordinates in mm from the lower left corner, seen from the top.
Outline: 0,0 82.55,0 82.55,76.2 0,76.2 0,0
Copper layers (1*16): Top 0.035mm / dielectric 1.5mm / Bottom 0.035mm
Design rules "default *": minimum track width 10mil, minimum drill 10mil, track to track 7mil, track to pad 7mil, pad to pad 7mil, via to via 7mil, smd to smd 7mil, copper to edge 10mil, drill to drill 8mil, minimum pad ring 10mil, minimum via ring 8mil, stop-mask expansion 4mil, vias tented up to drill 0mil, thermal gap 10mil

### Footprints (pad centres in the part's own frame; a part is rotated, then mirrored left to right if it is on the bottom)
0603 = smd 1.016 x 1.016: 1 -0.889,0; 2 0.889,0
EIA3216 = smd 1.4 x 1.6: A 1.4,0; C -1.4,0
PLCC4-2MM-RGB = smd 1 x 0.8: BLUE -0.75,-0.55; CA 0.75,-0.55; GREEN -0.75,0.55; RED 0.75,0.55
SOT23 = smd 1 x 1.4: 1 -0.95,-1.1; 2 0.95,-1.1; 3 0,1.1
SO08 = smd 0.61 x 2.21: 1 -1.905,-2.616; 2 -0.635,-2.616; 3 0.635,-2.616; 4 1.905,-2.616; 5 1.905,2.616; 6 0.635,2.616; 7 -0.635,2.616; 8 -1.905,2.616
SO8 = smd 0.6 x 2.2: 1 -1.905,-2.6; 2 -0.635,-2.6; 3 0.635,-2.6; 4 1.905,-2.6; 5 1.905,2.6; 6 0.635,2.6; 7 -0.635,2.6; 8 -1.905,2.6
DBV-R-PDSO-G5 = smd 0.6 x 1.2: 1 -0.95,-1.306; 2 0,-1.306; 3 0.95,-1.306; 4 0.95,1.306; 5 -0.95,1.306
MSOP10 = smd 0.25 x 1: 1 -1,-2.113; 2 -0.5,-2.113; 3 0,-2.113; 4 0.5,-2.113; 5 1,-2.113; 6 1,2.113; 7 0.5,2.113; 8 0,2.113; 9 -0.5,2.113; 10 -1,2.113
DBV_R-PDSO-G6 = smd 0.69 x 0.99: 1 -0.95,-1.29; 2 0,-1.29; 3 0.95,-1.29; 4 0.95,1.3; 5 0,1.3; 6 -0.95,1.3
SOT23-5 = smd 0.69 x 0.99: 1 -0.95,-1.29; 2 0,-1.29; 3 0.95,-1.29; 4 0.95,1.3; 5 -0.95,1.3
SO08' = smd 0.6 x 2.2: 1 -1.905,-2.6; 2 -0.635,-2.6; 3 0.635,-2.6; 4 1.905,-2.6; 5 1.905,2.6; 6 0.635,2.6; 7 -0.635,2.6; 8 -1.905,2.6
SJ = smd 1.168 x 1.6: 1 -0.762,0; 2 0.762,0
04C = drill 0.813 pad 1.905 octagon: 1 -1.905,0; 2 1.905,0; 3 5.715,0
JP1 = drill 0.914 long: 1 0,-1.27; 2 0,1.27
ASF = smd 1.6 x 1.5: 1 -1.25,-1.15; 2 1.25,-1.15; 3 1.25,1.15; 4 -1.25,1.15
3386H = drill 0.813 pad 1.676 octagon: 1 -2.54,0.635; 2 0,-1.905; 3 2.54,0.635
TACTILE_SWITCH_SMD = smd 1.25 x 0.65: 1 -1.875,0.775; 2 1.875,0.775; 3 -1.875,-0.775; 4 1.875,-0.775
TESTPOINT = smd 3.81 x 2.032: P$1 0,0
TSSOP8 = smd 0.9 x 0.35: 1 -2.875,0.975; 2 -2.875,0.325; 3 -2.875,-0.325; 4 -2.875,-0.975; 5 2.875,-0.975; 6 2.875,-0.325; 7 2.875,0.325; 8 2.875,0.975
TSSOP16 = smd 0.9 x 0.35: 1 -2.875,2.275; 2 -2.875,1.625; 3 -2.875,0.975; 4 -2.875,0.325; 5 -2.875,-0.325; 6 -2.875,-0.975; 7 -2.875,-1.625; 8 -2.875,-2.275; 9 2.875,-2.275; 10 2.875,-1.625; 11 2.875,-0.975; 12 2.875,-0.325; 13 2.875,0.325; 14 2.875,0.975; 15 2.875,1.625; 16 2.875,2.275
SO-08 = smd 0.6 x 2.2: 1 -1.905,-2.6; 2 -0.635,-2.6; 3 0.635,-2.6; 4 1.905,-2.6; 5 1.905,2.6; 6 0.635,2.6; 7 -0.635,2.6; 8 -1.905,2.6
QSOP20 = smd 0.4 x 1: 1 -2.858,-2.75; 2 -2.223,-2.75; 3 -1.588,-2.75; 4 -0.953,-2.75; 5 -0.318,-2.75; 6 0.318,-2.75; 7 0.953,-2.75; 8 1.588,-2.75; 9 2.223,-2.75; 10 2.858,-2.75; 11 2.858,2.75; 12 2.223,2.75; 13 1.588,2.75; 14 0.953,2.75; 15 0.318,2.75; 16 -0.318,2.75; 17 -0.953,2.75; 18 -1.588,2.75; 19 -2.223,2.75; 20 -2.858,2.75
SO8-POWER = smd 0.6 x 2.2: 1 -1.905,-2.6; 2 -0.635,-2.6; 3 0.635,-2.6; 4 1.905,-2.6; 5 1.905,2.6; 6 0.635,2.6; 7 -0.635,2.6; 8 -1.905,2.6 | smd 3.81 x 1.93: PAD 0,0
QFN24-4X4 = smd 0.7 x 0.25: 1 -1.9,1.25; 2 -1.9,0.75; 3 -1.9,0.25; 4 -1.9,-0.25; 5 -1.9,-0.75; 6 -1.9,-1.25; 13 1.9,-1.25; 14 1.9,-0.75; 15 1.9,-0.25; 16 1.9,0.25; 17 1.9,0.75; 18 1.9,1.25 | smd 0.25 x 0.7: 7 -1.25,-1.9; 8 -0.75,-1.9; 9 -0.25,-1.9; 10 0.25,-1.9; 11 0.75,-1.9; 12 1.25,-1.9; 19 1.25,1.9; 20 0.75,1.9; 21 0.25,1.9; 22 -0.25,1.9; 23 -0.75,1.9; 24 -1.25,1.9 | smd 2.45 x 2.45: EXP 0,0
WM-N-BM-14 = smd 1.2 x 0.6: 1 0.6,15.45; 2 0.6,14.45; 3 0.6,13.45; 4 0.6,12.45; 5 0.6,11.45; 6 0.6,10.45; 7 0.6,9.45; 8 0.6,8.45; 9 0.6,7.45; 10 0.6,6.45; 11 0.6,5.45; 12 0.6,4.45; 13 0.6,3.45; 14 0.6,2.45; 15 0.6,1.45; 33 19.4,1.45; 34 19.4,2.45; 35 19.4,3.45; 36 19.4,4.45; 37 19.4,5.45; 38 19.4,6.45; 39 19.4,7.45; 40 19.4,8.45; 41 19.4,9.45; 42 19.4,10.45; 43 19.4,11.45; 44 19.4,12.45; 45 19.4,13.45; 46 19.4,14.45; 47 19.4,15.45 | smd 0.6 x 1.2: 16 2,0.6; 17 3,0.6; 18 4,0.6; 19 5,0.6; 20 6,0.6; 21 7,0.6; 22 8,0.6; 23 9,0.6; 24 10,0.6; 25 11,0.6; 26 12,0.6; 27 13,0.6; 28 14,0.6; 29 15,0.6; 30 16,0.6; 31 17,0.6; 32 18,0.6; 48 18,16.3; 49 17,16.3; 50 16,16.3; 51 15,16.3; 52 14,16.3; 53 13,16.3; 54 12,16.3; 55 11,16.3; 56 10,16.3; 57 9,16.3; 58 8,16.3; 59 7,16.3; 60 6,16.3; 61 5,16.3; 62 4,16.3; 63 3,16.3; 64 2,16.3 | smd 1.2 x 1.2: 65 6.5,11.45; 66 6.5,8.45; 67 6.5,5.45; 68 10,11.45; 69 10,8.45; 70 10,5.45; 71 13.5,11.45; 72 13.5,8.45; 73 13.5,5.45; 74 19.12,27.07; 75 0.88,27.07
22-23-2021 = drill 1 long: 1 -1.27,0; 2 1.27,0
AMP_227161 = drill 0.9 pad 1.27: 1 0,-5.08; 2 -2.54,-5.08 | hole 2: -5.08,0; 5.08,0
22-23-2031 = drill 1 long: 1 -2.54,0; 2 0,0; 3 2.54,0
EZG-00-302 = drill 0.6 pad 1: 1 0,0.6; 2 0,-0.6 | drill 0.9 pad 1.2: M1 -2.54,2.54; M2 2.54,2.54; M3 2.54,-2.54; M4 -2.54,-2.54
SHF-105-01-X-D-SM = smd 0.737 x 2.794: 1 -2.54,-2.032; 2 -2.54,2.032; 3 -1.27,-2.032; 4 -1.27,2.032; 5 0,-2.032; 6 0,2.032; 7 1.27,-2.032; 8 1.27,2.032; 9 2.54,-2.032; 10 2.54,2.032
USB-MICROB = smd 0.35 x 1.4: D+ 0,2.65; D- -0.65,2.65; GND 1.3,2.65; ID 0.65,2.65; VBUS -1.3,2.65 | smd 1.8 x 1.9: MT1 -4,0; MT2 4,0 | smd 1.9 x 1.9: P$1 -1.27,0; P$2 1.27,0
MAB64 = drill 0.914 octagon: A1 -2.54,39.37; A2 -2.54,36.83; A3 -2.54,34.29; A4 -2.54,31.75; A5 -2.54,29.21; A6 -2.54,26.67; A7 -2.54,24.13; A8 -2.54,21.59; A9 -2.54,19.05; A10 -2.54,16.51; A11 -2.54,13.97; A12 -2.54,11.43; A13 -2.54,8.89; A14 -2.54,6.35; A15 -2.54,3.81; A16 -2.54,1.27; A17 -2.54,-1.27; A18 -2.54,-3.81; A19 -2.54,-6.35; A20 -2.54,-8.89; A21 -2.54,-11.43; A22 -2.54,-13.97; A23 -2.54,-16.51; A24 -2.54,-19.05; A25 -2.54,-21.59; A26 -2.54,-24.13; A27 -2.54,-26.67; A28 -2.54,-29.21; A29 -2.54,-31.75; A30 -2.54,-34.29; A31 -2.54,-36.83; A32 -2.54,-39.37; B1 -5.08,39.37; B2 -5.08,36.83; B3 -5.08,34.29; B4 -5.08,31.75; B5 -5.08,29.21; B6 -5.08,26.67; B7 -5.08,24.13; B8 -5.08,21.59; B9 -5.08,19.05; B10 -5.08,16.51; B11 -5.08,13.97; B12 -5.08,11.43; B13 -5.08,8.89; B14 -5.08,6.35; B15 -5.08,3.81; B16 -5.08,1.27; B17 -5.08,-1.27; B18 -5.08,-3.81; B19 -5.08,-6.35; B20 -5.08,-8.89; B21 -5.08,-11.43; B22 -5.08,-13.97; B23 -5.08,-16.51; B24 -5.08,-19.05; B25 -5.08,-21.59; B26 -5.08,-24.13; B27 -5.08,-26.67; B28 -5.08,-29.21; B29 -5.08,-31.75; B30 -5.08,-34.29; B31 -5.08,-36.83; B32 -5.08,-39.37 | hole 2.794: 0,44.45; 0,-44.45

### Placement (x,y rotation side)
C1  21.91,18.73 180 top
C2  -37.15,-77.41 0 top  (outside the outline)
C3  18.73,17.14 180 top
C4  -60.96,-136.08 0 top  (outside the outline)
C5  13.84,44.39 90 top
C6  5.71,47.05 0 top
C7  -44.83,-90.49 0 top  (outside the outline)
C8  -44.83,-94.87 0 top  (outside the outline)
C9  -44.83,-99.25 0 top  (outside the outline)
C10  -70.93,-200.53 0 top  (outside the outline)
C11  -70.93,-216.53 0 top  (outside the outline)
C12  -371.67,160.15 0 top  (outside the outline)
C13  -87.69,-263.46 0 top  (outside the outline)
C19  -177.29,-593.22 0 top  (outside the outline)
C22  -177.29,-598.55 0 top  (outside the outline)
C23  -177.74,-603.31 0 top  (outside the outline)
C24  -177.74,-607.7 0 top  (outside the outline)
C26  -195.77,-671.89 0 top  (outside the outline)
C27  -195.77,-685.04 0 top  (outside the outline)
C28  -195.77,-689.42 0 top  (outside the outline)
C29  -195.77,-693.8 0 top  (outside the outline)
C30  -204.53,-702.56 0 top  (outside the outline)
C31  -214.5,-816.8 0 top  (outside the outline)
C32  -224.47,-825.56 0 top  (outside the outline)
C33  -243.4,-847.47 0 top  (outside the outline)
C34  -303.15,-870.84 0 top  (outside the outline)
C35  -313.12,-879.6 0 top  (outside the outline)
C36  -313.12,-888.37 0 top  (outside the outline)
C37  -313.12,-892.75 0 top  (outside the outline)
C38  -313.12,-897.13 0 top  (outside the outline)
C39  -313.12,-901.51 0 top  (outside the outline)
C40  -331.85,-997.65 0 top  (outside the outline)
C41  -331.85,-1002.03 0 top  (outside the outline)
C42  -331.85,79.95 0 top  (outside the outline)
C43  -331.85,84.33 0 top  (outside the outline)
C44  -338.45,133.48 0 top  (outside the outline)
C45  -332.55,133.48 0 top  (outside the outline)
C46  -327.09,133.1 0 top  (outside the outline)
C47  -348.87,144.34 0 top  (outside the outline)
C48  -371.67,198.56 0 top  (outside the outline)
C49  17.78,26.42 180 top
C50  16.83,37.47 180 top
C51  25.4,32.32 180 top
C52  26.04,21.27 180 top
C53  17.46,44.45 270 top
C54  24.45,44.45 270 top
C55  15.88,44.45 270 top
C56  26.04,44.45 270 top
C57  -371.67,202.95 0 top  (outside the outline)
C58  -371.67,207.33 0 top  (outside the outline)
C59  -371.67,211.71 0 top  (outside the outline)
C60  -371.67,227.33 0 top  (outside the outline)
C61  -374.14,260.1 0 top  (outside the outline)
C62  -368.94,260.1 0 top  (outside the outline)
C64  -477.65,-1133.98 0 top  (outside the outline)
C65  -477.65,-1138.36 0 top  (outside the outline)
C70  -477.65,326.2 0 top  (outside the outline)
C71  -477.65,330.58 0 top  (outside the outline)
C72  -500.13,334.96 0 top  (outside the outline)
C73  -500.13,339.34 0 top  (outside the outline)
C74  -500.13,343.73 0 top  (outside the outline)
C75  -500.13,348.11 0 top  (outside the outline)
C76  -500.13,352.49 0 top  (outside the outline)
C78  -500.13,361.25 0 top  (outside the outline)
D0  -371.79,168.72 0 top  (outside the outline)
D2  -297.12,-865.06 0 top  (outside the outline)
D4  -48.13,-190.94 0 top  (outside the outline)
D5  -71.06,-210.76 0 top  (outside the outline)
D7  -500.32,-1223.14 0 top  (outside the outline)
D9  -500.32,-1215.71 0 top  (outside the outline)
IC1  -7.3,-15.88 0 top  (outside the outline)
IC3  -68.52,-132.72 0 top  (outside the outline)
IC4  -59.94,-121.86 0 top  (outside the outline)
IC5  -43.56,-76.33 0 top  (outside the outline)
IC6  -68.52,-145.99 0 top  (outside the outline)
IC7  -320.68,-936.24 0 top  (outside the outline)
IC8  -368.74,251.46 0 top  (outside the outline)
IC9  -87.88,-257.68 0 top  (outside the outline)
IC12  -193.36,-604.33 0 top  (outside the outline)
IC13  -346.9,109.47 0 top  (outside the outline)
IC14  -204.66,-727.65 0 top  (outside the outline)
IC15  -250.76,-849.82 0 top  (outside the outline)
IC16  -222.06,-817.82 0 top  (outside the outline)
IC17  LT1671  [SO08']  -241.49,-830.96 0 top  (outside the outline)
IC18  -258.64,-849.82 0 top  (outside the outline)
IC19  -378.27,251.4 0 top  (outside the outline)
IC20  -378.27,235.01 0 top  (outside the outline)
J1  15.24,51.44 90 top
J2  -339.98,-1013.84 0 top  (outside the outline)
J3  -186.88,-619.51 0 top  (outside the outline)
JP0  -292.42,-845.76 0 top  (outside the outline)
Q1  -43.5,-84.07 0 top  (outside the outline)
R1  6.35,44.45 270 top
R2  -44.83,-103.63 0 top  (outside the outline)
R3  -37.15,-32.45 0 top  (outside the outline)
R4  -37.15,-36.83 0 top  (outside the outline)
R5  -79.88,-225.3 0 top  (outside the outline)
R6  -60.96,-127.32 0 top  (outside the outline)
R7  -37.15,-41.21 0 top  (outside the outline)
R8  -60.96,-131.7 0 top  (outside the outline)
R9  -37.15,-61.21 0 top  (outside the outline)
R10  -79.88,-229.68 0 top  (outside the outline)
R11  -380.68,267.53 0 top  (outside the outline)
R12  -79.88,-251.65 0 top  (outside the outline)
R13  -79.88,-220.92 0 top  (outside the outline)
R14  -55.31,-200.53 0 top  (outside the outline)
R15  -36.45,-114.94 0 top  (outside the outline)
R20  -375.48,267.53 0 top  (outside the outline)
R21  -500.13,-1190.43 0 top  (outside the outline)
R22  -500.13,-1194.82 0 top  (outside the outline)
R35  -204.53,-769.94 0 top  (outside the outline)
R36  -195.77,-680.66 0 top  (outside the outline)
R37  -195.77,-698.18 0 top  (outside the outline)
R38  -204.53,-737.81 0 top  (outside the outline)
R39  -303.15,-875.22 0 top  (outside the outline)
R40  -313.12,-883.98 0 top  (outside the outline)
R41  -331.85,-961.45 0 top  (outside the outline)
R42  -214.5,-812.42 0 top  (outside the outline)
R43  -214.5,-821.18 0 top  (outside the outline)
R44  -234.44,-829.95 0 top  (outside the outline)
R45  -234.44,-834.33 0 top  (outside the outline)
R46  -243.4,-838.71 0 top  (outside the outline)
R47  -243.4,-843.09 0 top  (outside the outline)
R48  -331.85,-965.84 0 top  (outside the outline)
R49  -331.85,-977.65 0 top  (outside the outline)
R50  -331.85,-982.03 0 top  (outside the outline)
R51  -348.87,101.73 0 top  (outside the outline)
R52  -348.87,-1025.46 0 top  (outside the outline)
R53  -348.87,-1029.84 0 top  (outside the outline)
R54  -343.66,144.34 0 top  (outside the outline)
R55  -348.87,-1034.22 0 top  (outside the outline)
R56  -348.87,-1038.61 0 top  (outside the outline)
R57  -348.87,-1062.16 0 top  (outside the outline)
R58  -366.46,160.15 0 top  (outside the outline)
R59  -371.67,173.35 0 top  (outside the outline)
R60  -366.46,173.35 0 top  (outside the outline)
R61  -371.67,177.74 0 top  (outside the outline)
R62  -371.67,190.25 0 top  (outside the outline)
R63  -366.46,190.25 0 top  (outside the outline)
R64  -371.67,-1066.55 0 top  (outside the outline)
R65  -371.67,-1070.93 0 top  (outside the outline)
R66  -371.67,-1075.31 0 top  (outside the outline)
R67  -380.68,243.71 0 top  (outside the outline)
R68  -370.27,267.53 0 top  (outside the outline)
R69  -380.68,-1079.69 0 top  (outside the outline)
R70  -375.48,271.91 0 top  (outside the outline)
R71  -380.68,287.53 0 top  (outside the outline)
R72  -380.68,-1084.07 0 top  (outside the outline)
R73  -380.68,-1088.45 0 top  (outside the outline)
R74  -380.68,-1092.84 0 top  (outside the outline)
S1  -370.27,163.77 0 top  (outside the outline)
S2  -370.27,193.87 0 top  (outside the outline)
T1  -331.98,-971.87 0 top  (outside the outline)
TP1  34.92,24.77 0 top
U1  -295.15,-857.76 0 top  (outside the outline)
U2  20.95,34.92 0 top
U4  -302.64,-863.66 0 top  (outside the outline)
U5  -310.71,-871.86 0 top  (outside the outline)
U6  -371.41,219.39 0 top  (outside the outline)
U7  -330.07,-954.98 0 top  (outside the outline)
U8  -328.04,-989.97 0 top  (outside the outline)
U9  -330.33,90.68 0 top  (outside the outline)
U10  -346.46,136.4 0 top  (outside the outline)
U11  -378.27,279.59 0 top  (outside the outline)
U$2  -330.07,-945.58 0 top  (outside the outline)
U$3  -372.87,-1062.99 0 top  (outside the outline)
X2  15.24,70.1 0 top
X3  -188.72,-657.67 0 top  (outside the outline)
X4  23.18,58.1 0 top
X5  -341.88,-992.19 0 top  (outside the outline)
X6  7.3,58.1 0 top
X7  -341.88,-1050.48 0 top  (outside the outline)
X8  -373.63,299.21 0 top  (outside the outline)
X9  -367.35,152.15 0 top  (outside the outline)
X10  -369.25,183.51 0 top  (outside the outline)
X11  -390.65,-1082.99 0 top  (outside the outline)
X14  -450.72,-1103.57 0 top  (outside the outline)
X15  -332.93,-1276.92 0 top  (outside the outline)

### Tracks (layer width: path | path; a pad name or v marks a point on that pad's centre or on a via)
2.5V  (5 unrouted)
3.3V  (26 unrouted)
5V_REF  (5 unrouted)
!CNV_RESET!  (1 unrouted)
!DAC_RESET!  (1 unrouted)
!EEPROM_SELECT!  (1 unrouted)
!P1_RESET  (4 unrouted)
!PDAG_CS!  (1 unrouted)
!SETUP  (2 unrouted)
+3.3V  (16 unrouted)
+5V  (20 unrouted)
+15V  (3 unrouted)
-5V  (8 unrouted)
-15V  (3 unrouted)
ABOVE_THRESHOLD  (2 unrouted)
AGND  (82 unrouted)
AGND1  (3 unrouted)
CAVITY_DRIVE_RAW  (2 unrouted)
CONVERT  (4 unrouted)
D+  (1 unrouted)
D-  (1 unrouted)
DAC_RSTSEL  (1 unrouted)
DERIVATIVE_ZERO_CROSSING  (2 unrouted)
GND  (via drill 0.3)  (82 unrouted)
  Top 0.406: C51.1 v27.62,32.32 | C55.2 C53.2 v17.46,42.23 | C56.1 C54.1 v24.45,46.67 | v15.56,26.42 C49.2 | C6.1 v3.49,47.05 | C5.2 v13.84,46.67 | C50.2 v14.61,37.47 | C52.1 v28.26,21.27
  Top 0.813: v34.92,26.99 TP1.P$1 | TP1.P$1 v31.75,24.77 | TP1.P$1 v38.1,24.77 | TP1.P$1 v34.92,22.54
  pour Bottom: 1.27,1.27 1.27,74.93 81.28,74.93 81.28,1.27
I2C_CLK  (2 unrouted)
I2C_DAT  (2 unrouted)
LOCK  (2 unrouted)
N2  (2 unrouted)
N$1  (1 unrouted)
N$3  (1 unrouted)
N$4  (4 unrouted)
N$6  (2 unrouted)
N$9  (1 unrouted)
N$10  (1 unrouted)
N$11  (3 unrouted)
N$12  (3 unrouted)
N$13  (3 unrouted)
N$14  (1 unrouted)
N$15  (2 unrouted)
N$16  (3 unrouted)
N$17  (3 unrouted)
N$18  (3 unrouted)
N$19  (1 unrouted)
N$23  (1 unrouted)
N$24  (1 unrouted)
N$25  (1 unrouted)
N$26  (1 unrouted)
N$27  (1 unrouted)
N$28  (1 unrouted)
N$29  (2 unrouted)
N$41  (2 unrouted)
N$47  (1 unrouted)
N$48  (5 unrouted)
N$49  (2 unrouted)
N$50  (2 unrouted)
N$51  (1 unrouted)
N$52  (2 unrouted)
N$53  (3 unrouted)
N$54  (1 unrouted)
N$55  (1 unrouted)
N$56  (2 unrouted)
N$57  (1 unrouted)
N$58  (1 unrouted)
N$59  (1 unrouted)
N$60  (1 unrouted)
N$61  (4 unrouted)
N$62  (1 unrouted)
N$63  (3 unrouted)
N$64  (3 unrouted)
N$65  (3 unrouted)
N$66  (2 unrouted)
N$67  (2 unrouted)
N$70  (3 unrouted)
N$71  (2 unrouted)
N$72  (1 unrouted)
N$73  (1 unrouted)
N$74  (2 unrouted)
N$75  (1 unrouted)
N$76  (1 unrouted)
N$77  (2 unrouted)
N$78  (1 unrouted)
N$79  (1 unrouted)
N$80  (1 unrouted)
N$81  (1 unrouted)
N$82  (1 unrouted)
N$83  (2 unrouted)
N$84  (1 unrouted)
N$85  (3 unrouted)
N$86  (1 unrouted)
P1_SWDCLK  (1 unrouted)
P1_SWDIO  (1 unrouted)
PDA_EXT/!INT!  (1 unrouted)
PDA_INTERNAL/!EXTERNAL!  (2 unrouted)
PHOTODIODE  (1 unrouted)
RAMP_CLK  (2 unrouted)
RAMP_INDICATOR  (1 unrouted)
RAMP_RAW  (1 unrouted)
RGB_BLUE  (1 unrouted)
RGB_GREEN  (1 unrouted)
RGB_RED  (1 unrouted)
SPI_CLK  (8 unrouted)
SPI_MISO  (7 unrouted)
SPI_MOSI  (8 unrouted)
THRESHOLD  (2 unrouted)
TWG_RAW  (3 unrouted)
UC_RX  (1 unrouted)
UC_TX  (1 unrouted)
V+  (via drill 0.3)  (19 unrouted)
  Top 0.406: C49.1 | 17.72,36.41 17.72,36.26 18.1,35.88 19.88,35.88 20.32,36.32 | 20.32,45.66 20,45.34 C53.1 C55.1 v15.88,46.67 | 10.79,43.18 11.11,43.5 C5.1 v13.84,42.48
  Top 0.813: v13.84,42.48 17.72,38.61 C50.1 17.72,36.41 18.1,36.03 v18.1,34.61
  Bottom 0.813: v15.88,46.67 15.88,44.51 v13.84,42.48 13.78,42.42 7.3,42.42 5.02,44.7 5.02,48.58 5.97,49.53 7.94,49.53 8.57,50.16 | v20,28.57 20,32.7 v18.1,34.61
V-  (via drill 0.3)  (17 unrouted)
  Top 0.305: 24.5,32.31 C51.2
  Top 0.406: C54.2 C56.2 | 23.87,21.27 24.26,21.27 | 8.25,47.05 C6.2 | C51.2 24.51,31.37 v25.08,30.8 | 22.86,43.24 23.18,43.56
  Top 0.813: 23.18,43.56 C54.2 v24.45,42.23 | C6.2 v6.6,48.32 | 24.26,21.27 C52.2 v25.15,19.68
  Bottom 0.813: v6.6,48.32 21.89,48.32 21.91,48.46 21.91,44.77 v24.45,42.23 25.08,41.59 v25.08,30.8 25.15,30.73 v25.15,19.68
ZDCAT_ENABLE  (1 unrouted)

### Text on the board
tPlace: + 0 - | + 0 - | Iout | gnd | Iout | gnd | Iout | gnd | gnd | CCM_0009 / Precision Bipolar Current Driver (x3) / N. Fitch / Aug. 2017